# EasyEDA schematic SCH_RP2040_Carrier_Board_for_AC_and_Measurement_Applications.json

## Sheets
1 Temperature/Analog Multiplexer: TITLE: Temperature Sensors and one Hygro; REV: 1.0; Date: 2022-06-06; Sheet: 1/4; Drawn By: GoRoNb; Company: https://github.com/gormr
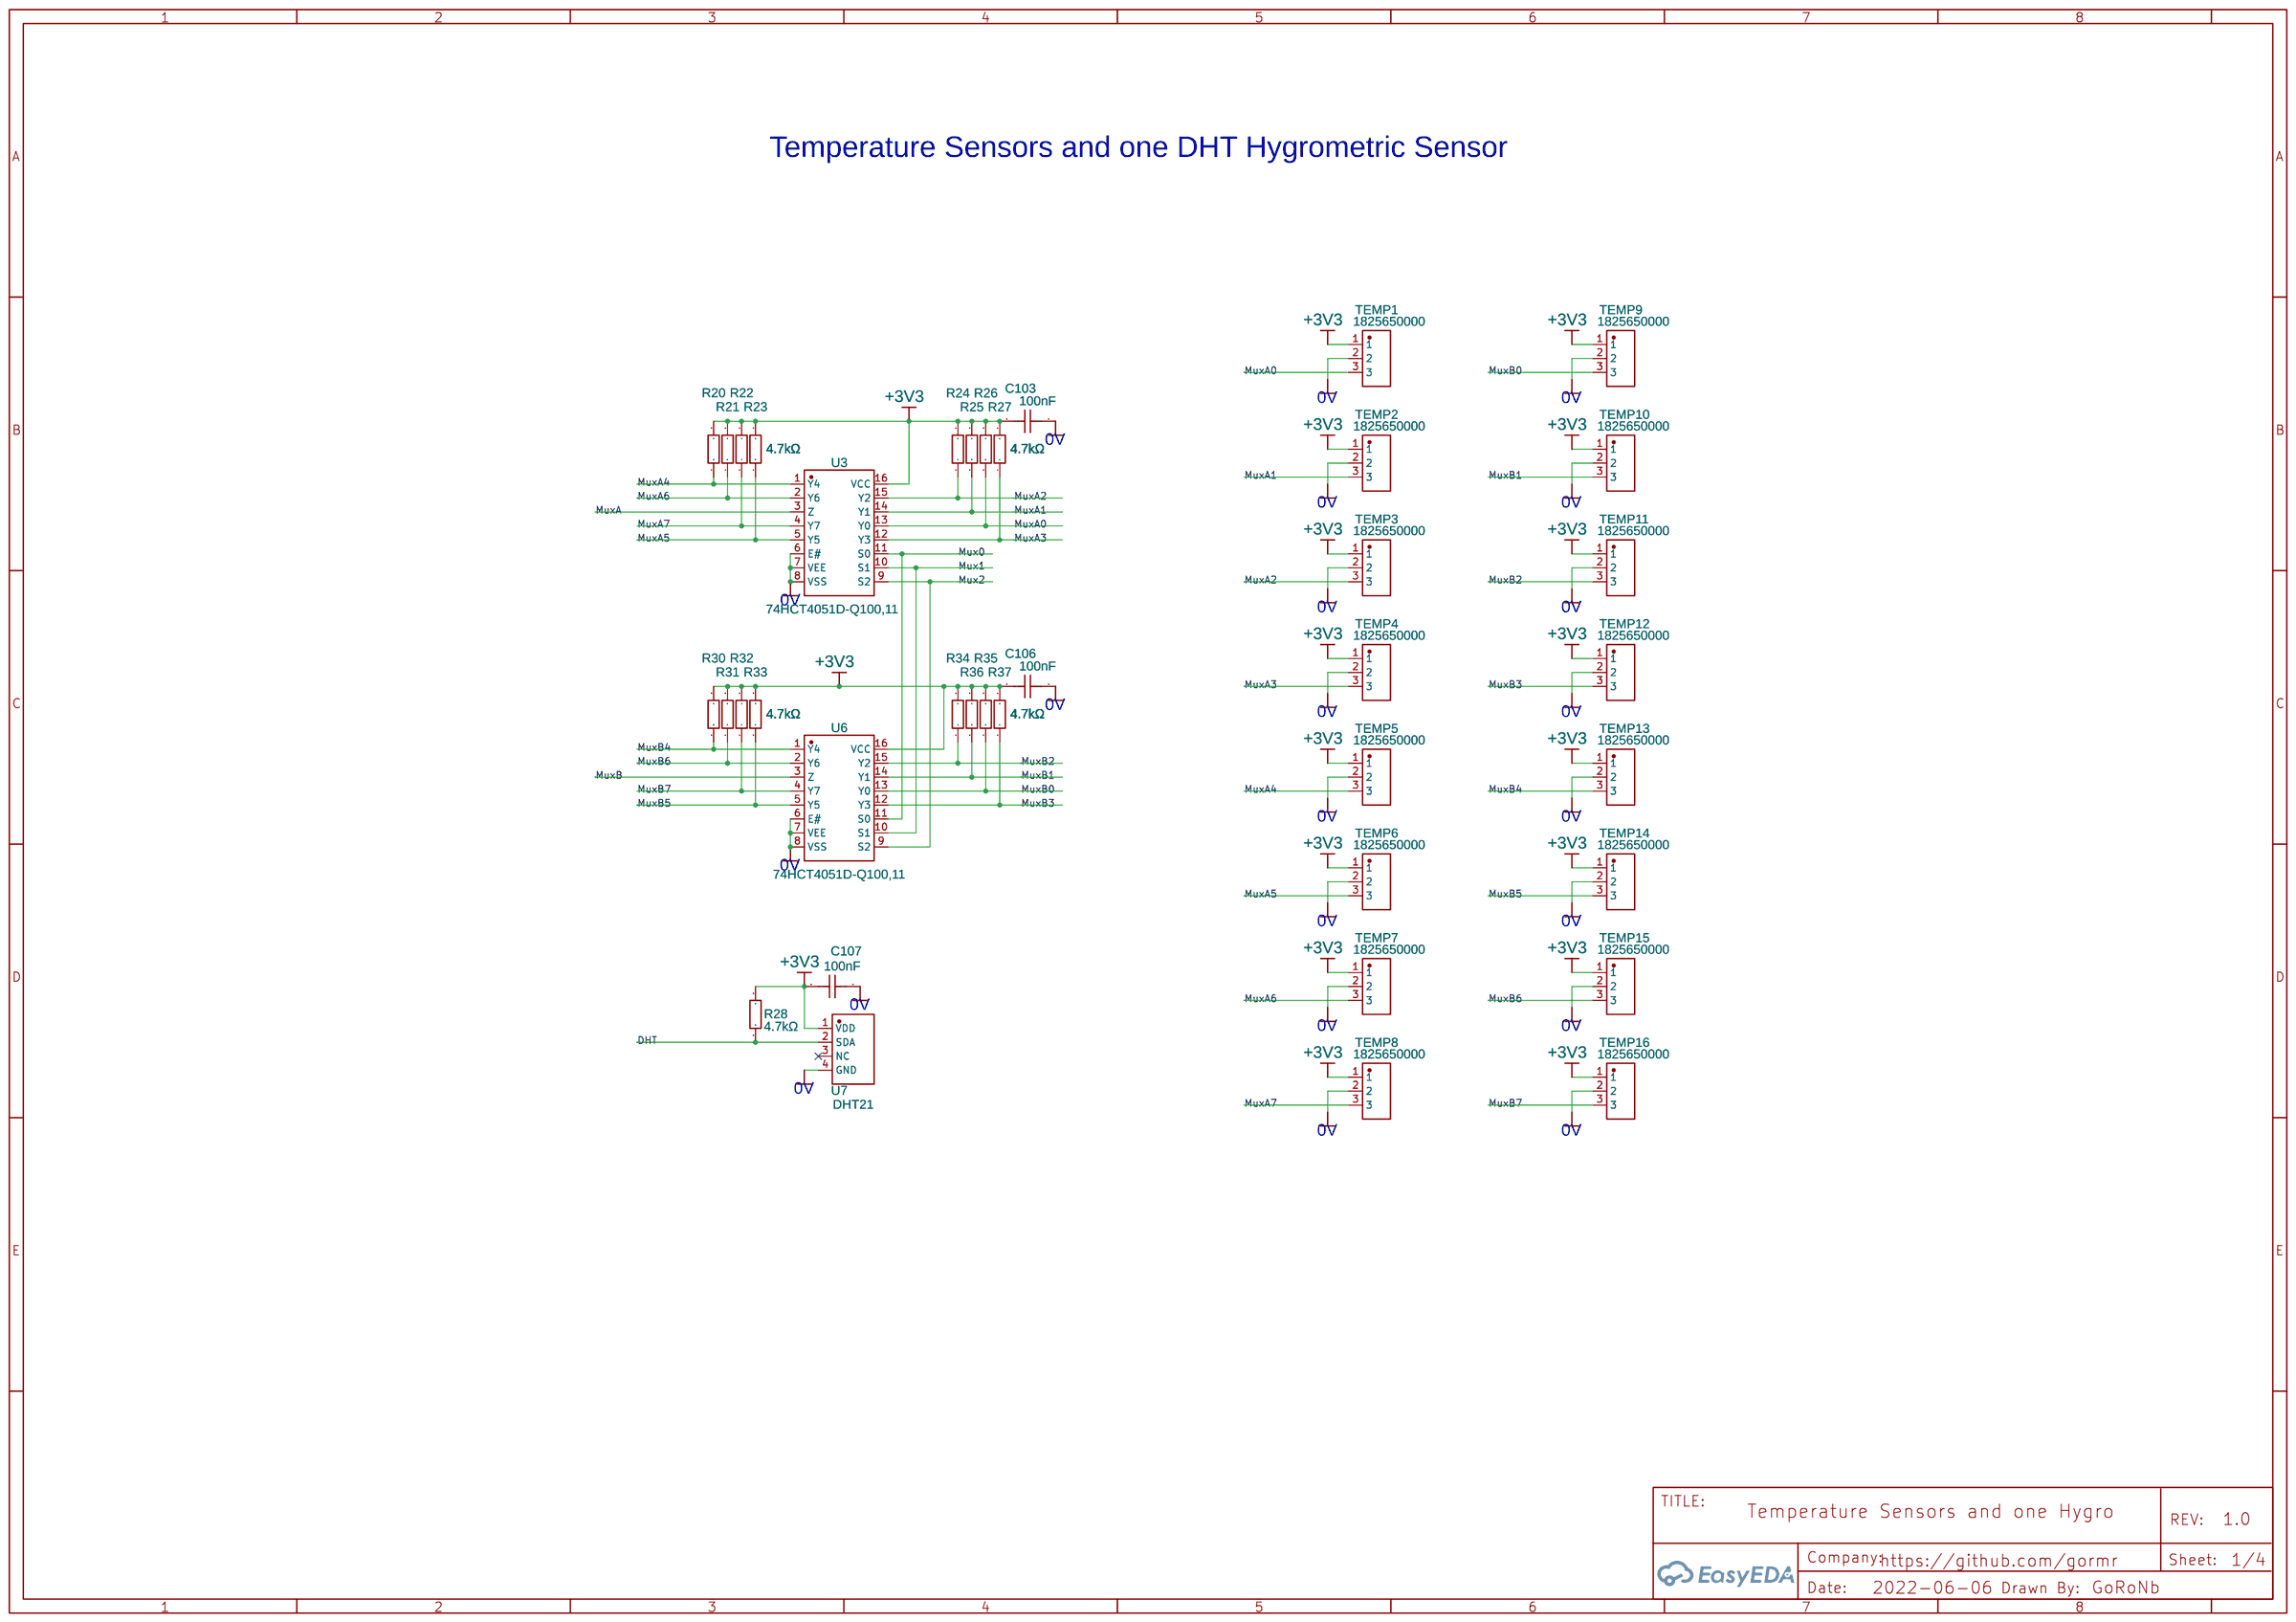
[diagram p0: Temperature/Analog Multiplexer]
2 Controller Unit: TITLE: µC Unit; Sheet: 2/4
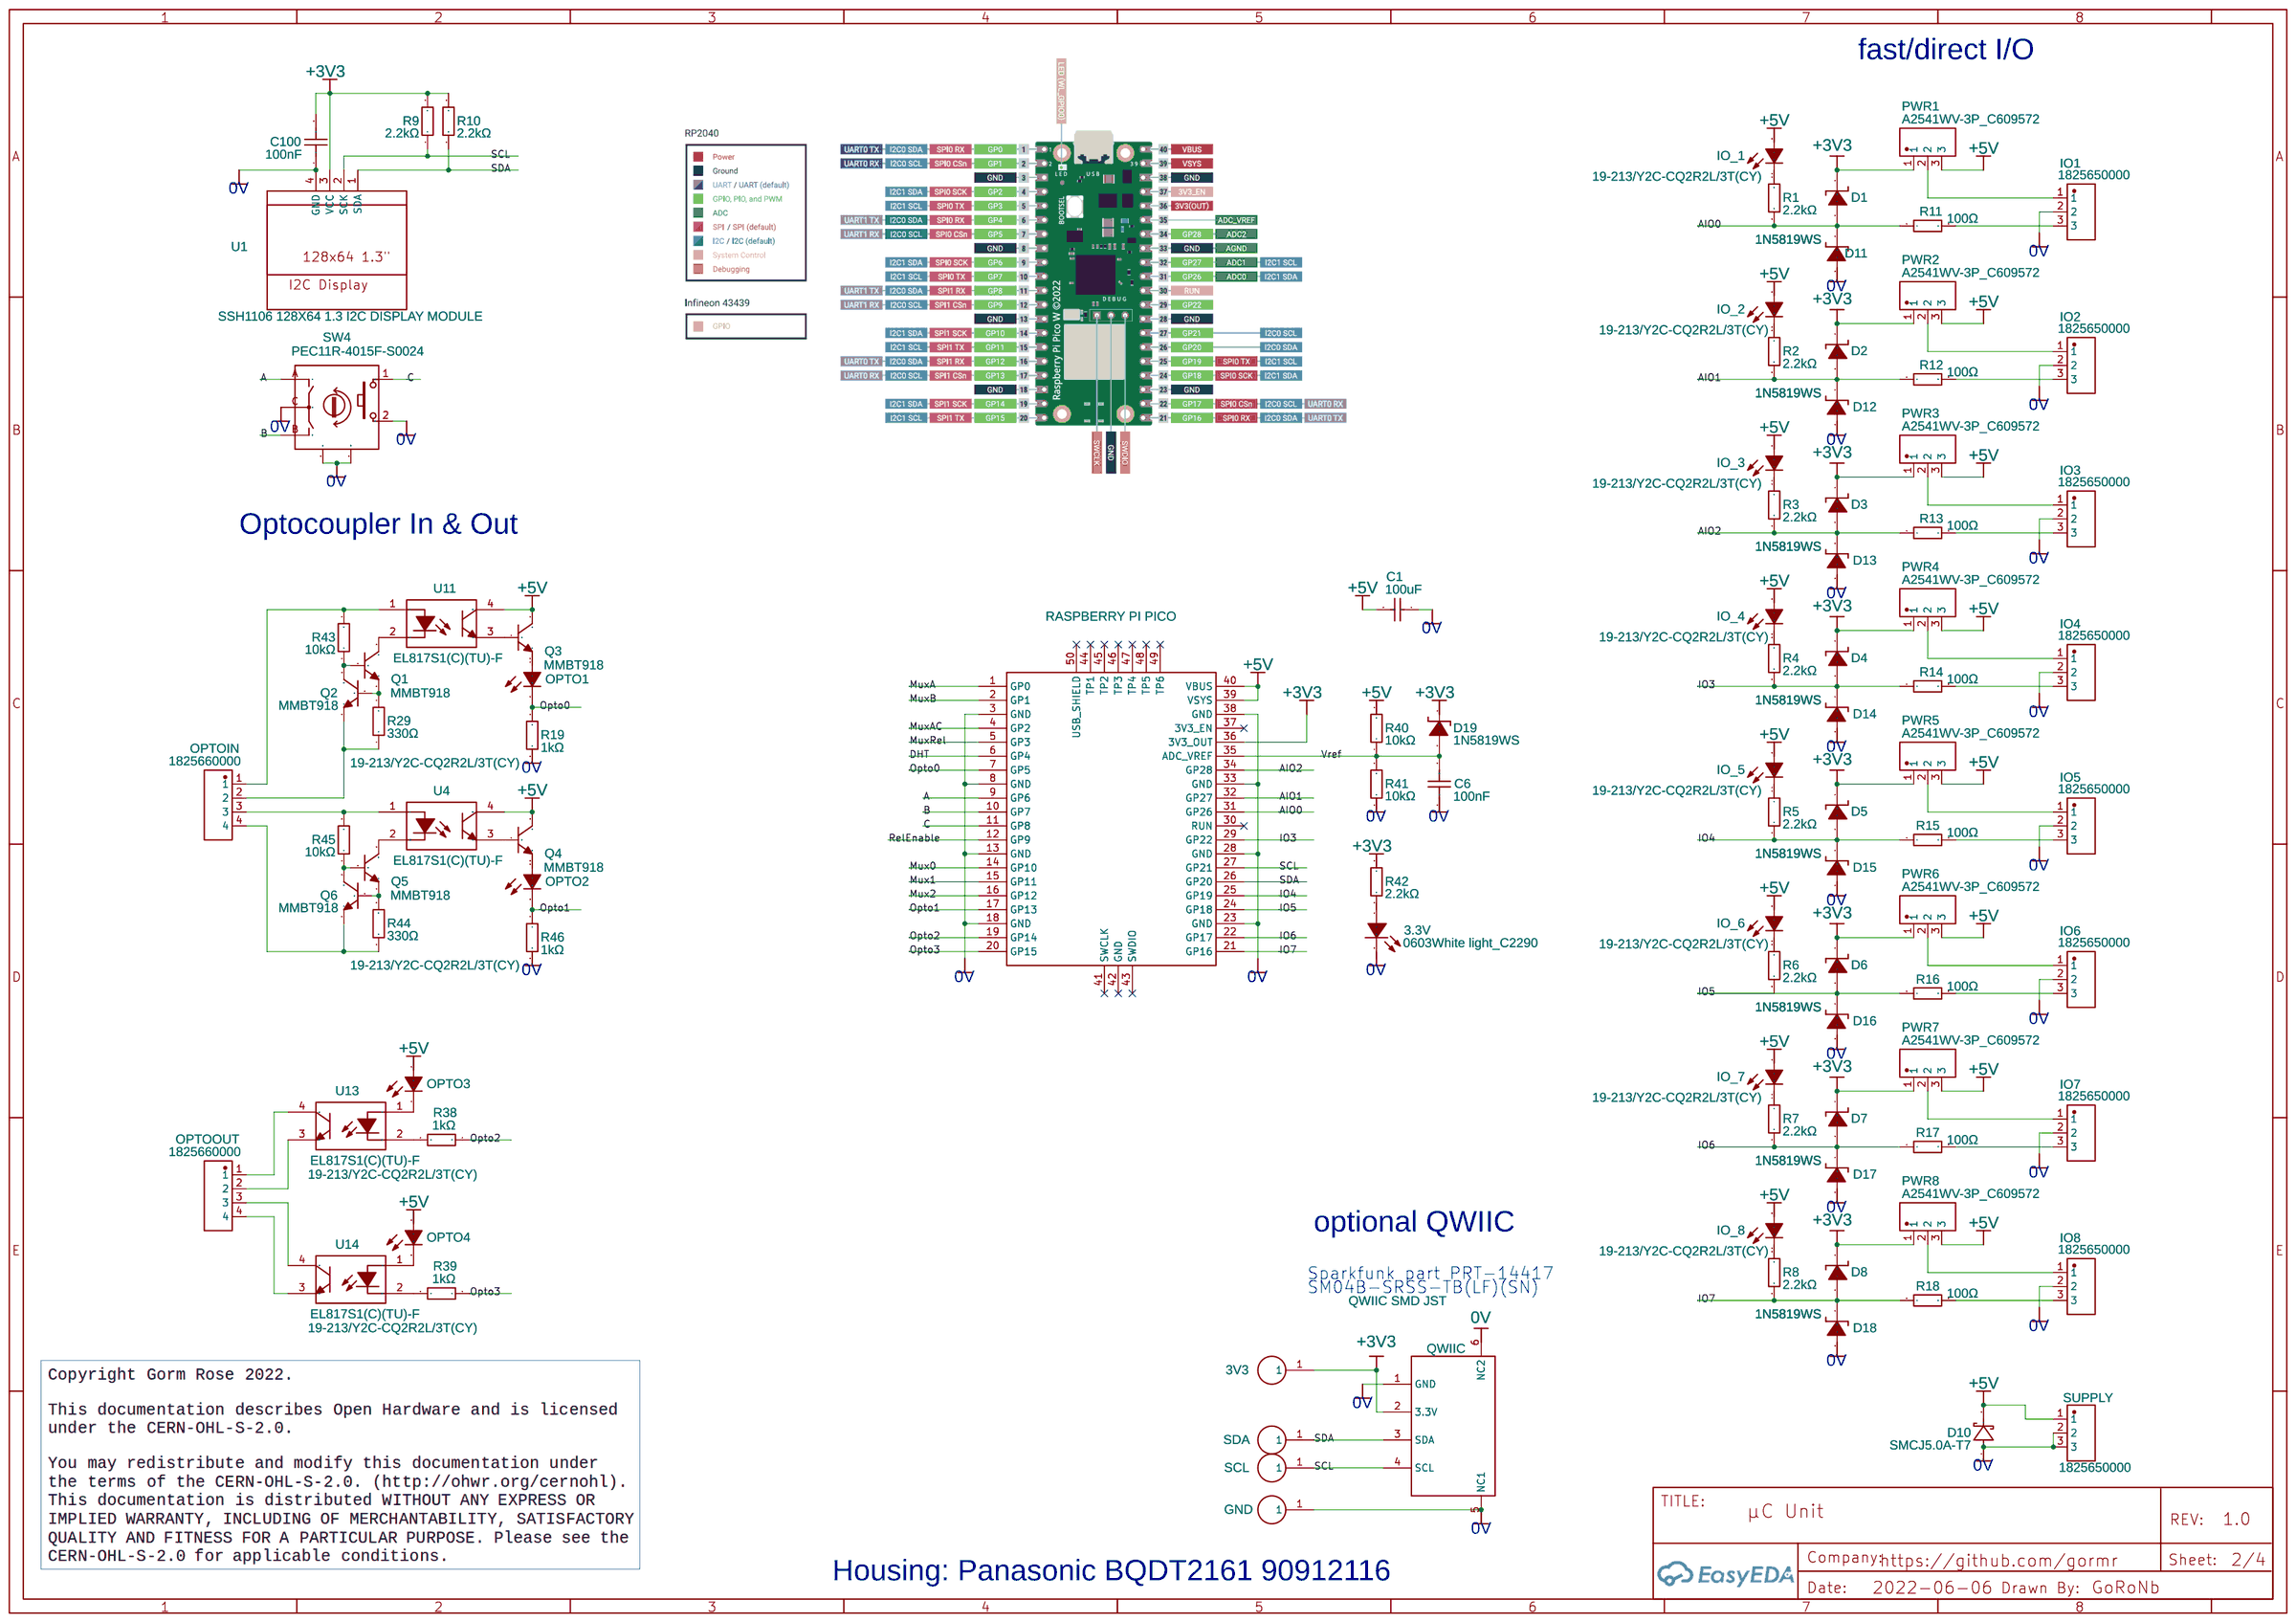
[diagram p1: Controller Unit]
3 AC inputs: TITLE: AC inputs; Sheet: 3/4
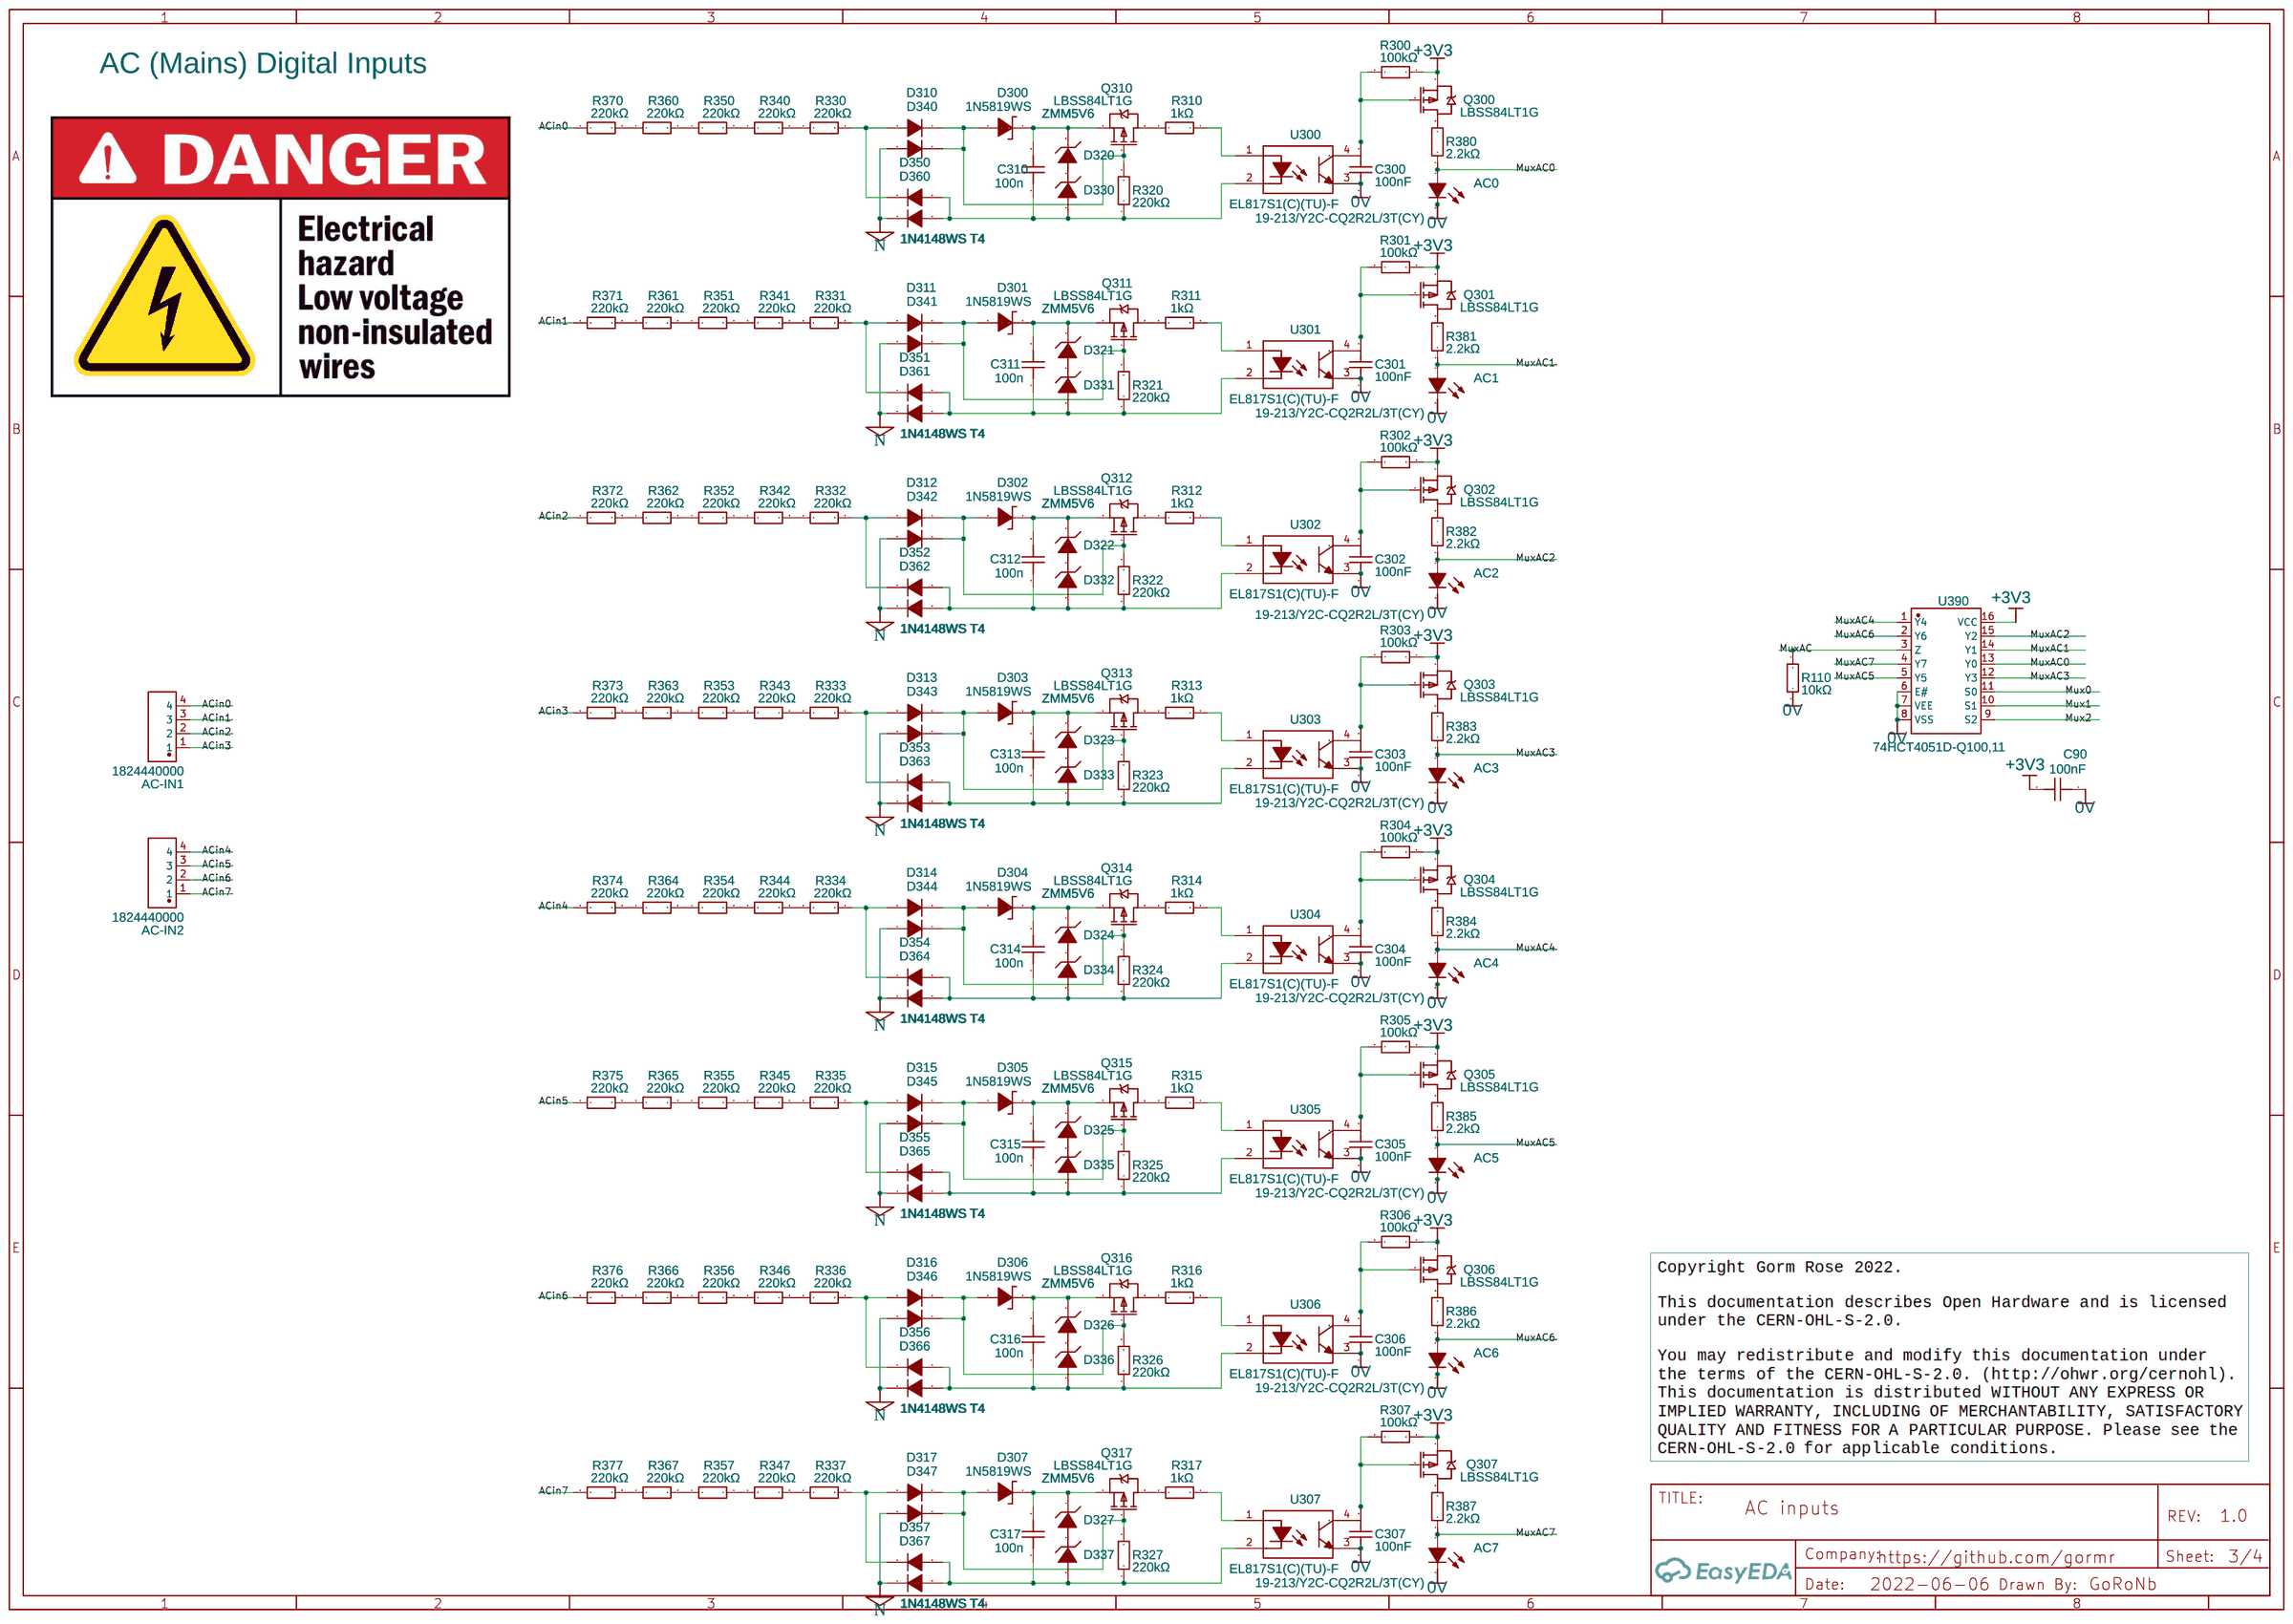
[diagram p2: AC inputs]
4 Relay Outputs: TITLE: Relay Outputs; Sheet: 4/4
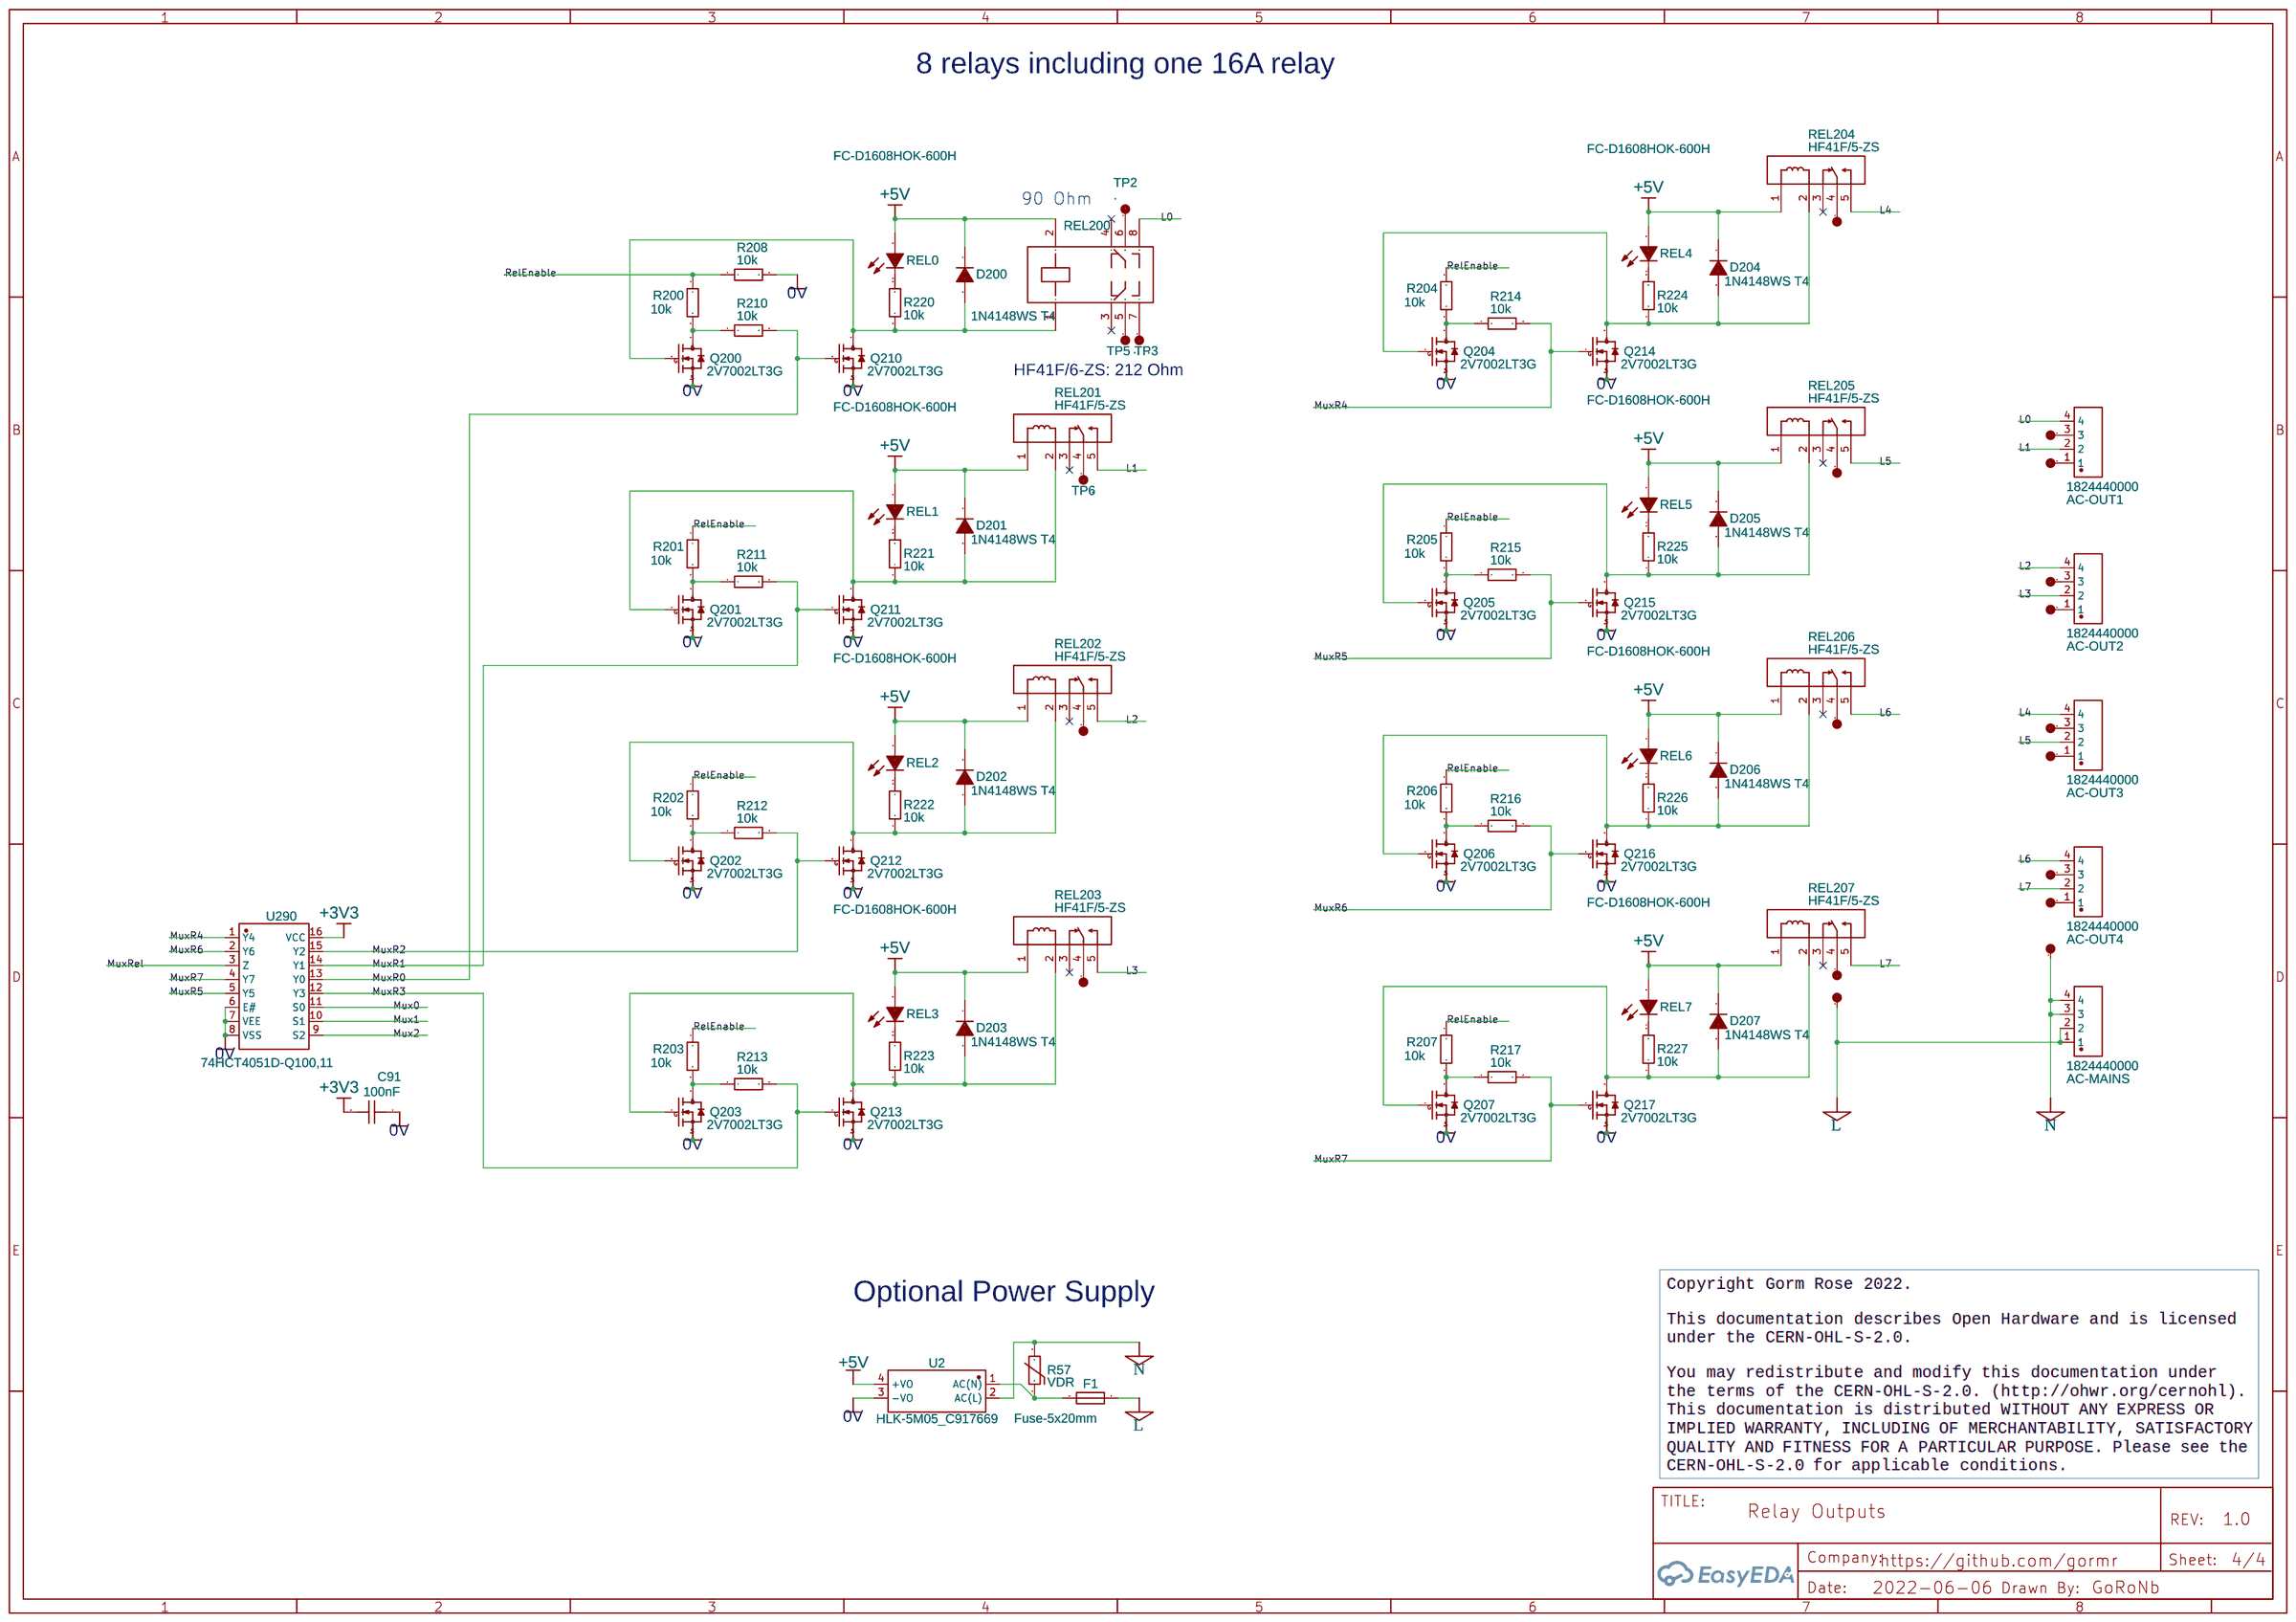
[diagram p3: Relay Outputs]

## Parts
sheet AC inputs
AC0  19-213/Y2C-CQ2R2L/3T(CY)  [LED0603-R-RD]
AC1  19-213/Y2C-CQ2R2L/3T(CY)  [LED0603-R-RD]
AC2  19-213/Y2C-CQ2R2L/3T(CY)  [LED0603-R-RD]
AC3  19-213/Y2C-CQ2R2L/3T(CY)  [LED0603-R-RD]
AC4  19-213/Y2C-CQ2R2L/3T(CY)  [LED0603-R-RD]
AC5  19-213/Y2C-CQ2R2L/3T(CY)  [LED0603-R-RD]
AC6  19-213/Y2C-CQ2R2L/3T(CY)  [LED0603-R-RD]
AC7  19-213/Y2C-CQ2R2L/3T(CY)  [LED0603-R-RD]
AC-IN1  1824440000  [1824440000]
AC-IN2  1824440000  [1824440000]
C90  100nF  [C0603]
C300  100nF  [C0603]
C301  100nF  [C0603]
C302  100nF  [C0603]
C303  100nF  [C0603]
C304  100nF  [C0603]
C305  100nF  [C0603]
C306  100nF  [C0603]
C307  100nF  [C0603]
C310  100n  [C0603]
C311  100n  [C0603]
C312  100n  [C0603]
C313  100n  [C0603]
C314  100n  [C0603]
C315  100n  [C0603]
C316  100n  [C0603]
C317  100n  [C0603]
D300  1N5819WS  [SOD-323_L1.8-W1.3-LS2.5-RD]
D301  1N5819WS  [SOD-323_L1.8-W1.3-LS2.5-RD]
D302  1N5819WS  [SOD-323_L1.8-W1.3-LS2.5-RD]
D303  1N5819WS  [SOD-323_L1.8-W1.3-LS2.5-RD]
D304  1N5819WS  [SOD-323_L1.8-W1.3-LS2.5-RD]
D305  1N5819WS  [SOD-323_L1.8-W1.3-LS2.5-RD]
D306  1N5819WS  [SOD-323_L1.8-W1.3-LS2.5-RD]
D307  1N5819WS  [SOD-323_L1.8-W1.3-LS2.5-RD]
D310  1N4148WS T4  [SOD-323_L1.8-W1.3-LS2.5-RD]
D311  1N4148WS T4  [SOD-323_L1.8-W1.3-LS2.5-RD]
D312  1N4148WS T4  [SOD-323_L1.8-W1.3-LS2.5-RD]
D313  1N4148WS T4  [SOD-323_L1.8-W1.3-LS2.5-RD]
D314  1N4148WS T4  [SOD-323_L1.8-W1.3-LS2.5-RD]
D315  1N4148WS T4  [SOD-323_L1.8-W1.3-LS2.5-RD]
D316  1N4148WS T4  [SOD-323_L1.8-W1.3-LS2.5-RD]
D317  1N4148WS T4  [SOD-323_L1.8-W1.3-LS2.5-RD]
D320  ZMM5V6  [LL-34_L3.5-W1.5-RD]
D321  ZMM5V6  [LL-34_L3.5-W1.5-RD]
D322  ZMM5V6  [LL-34_L3.5-W1.5-RD]
D323  ZMM5V6  [LL-34_L3.5-W1.5-RD]
D324  ZMM5V6  [LL-34_L3.5-W1.5-RD]
D325  ZMM5V6  [LL-34_L3.5-W1.5-RD]
D326  ZMM5V6  [LL-34_L3.5-W1.5-RD]
D327  ZMM5V6  [LL-34_L3.5-W1.5-RD]
D330  ZMM5V6  [LL-34_L3.5-W1.5-RD]
D331  ZMM5V6  [LL-34_L3.5-W1.5-RD]
D332  ZMM5V6  [LL-34_L3.5-W1.5-RD]
D333  ZMM5V6  [LL-34_L3.5-W1.5-RD]
D334  ZMM5V6  [LL-34_L3.5-W1.5-RD]
D335  ZMM5V6  [LL-34_L3.5-W1.5-RD]
D336  ZMM5V6  [LL-34_L3.5-W1.5-RD]
D337  ZMM5V6  [LL-34_L3.5-W1.5-RD]
D340  1N4148WS T4  [SOD-323_L1.8-W1.3-LS2.5-RD]
D341  1N4148WS T4  [SOD-323_L1.8-W1.3-LS2.5-RD]
D342  1N4148WS T4  [SOD-323_L1.8-W1.3-LS2.5-RD]
D343  1N4148WS T4  [SOD-323_L1.8-W1.3-LS2.5-RD]
D344  1N4148WS T4  [SOD-323_L1.8-W1.3-LS2.5-RD]
D345  1N4148WS T4  [SOD-323_L1.8-W1.3-LS2.5-RD]
D346  1N4148WS T4  [SOD-323_L1.8-W1.3-LS2.5-RD]
D347  1N4148WS T4  [SOD-323_L1.8-W1.3-LS2.5-RD]
D350  1N4148WS T4  [SOD-323_L1.8-W1.3-LS2.5-RD]
D351  1N4148WS T4  [SOD-323_L1.8-W1.3-LS2.5-RD]
D352  1N4148WS T4  [SOD-323_L1.8-W1.3-LS2.5-RD]
D353  1N4148WS T4  [SOD-323_L1.8-W1.3-LS2.5-RD]
D354  1N4148WS T4  [SOD-323_L1.8-W1.3-LS2.5-RD]
D355  1N4148WS T4  [SOD-323_L1.8-W1.3-LS2.5-RD]
D356  1N4148WS T4  [SOD-323_L1.8-W1.3-LS2.5-RD]
D357  1N4148WS T4  [SOD-323_L1.8-W1.3-LS2.5-RD]
D360  1N4148WS T4  [SOD-323_L1.8-W1.3-LS2.5-RD]
D361  1N4148WS T4  [SOD-323_L1.8-W1.3-LS2.5-RD]
D362  1N4148WS T4  [SOD-323_L1.8-W1.3-LS2.5-RD]
D363  1N4148WS T4  [SOD-323_L1.8-W1.3-LS2.5-RD]
D364  1N4148WS T4  [SOD-323_L1.8-W1.3-LS2.5-RD]
D365  1N4148WS T4  [SOD-323_L1.8-W1.3-LS2.5-RD]
D366  1N4148WS T4  [SOD-323_L1.8-W1.3-LS2.5-RD]
D367  1N4148WS T4  [SOD-323_L1.8-W1.3-LS2.5-RD]
Q300  LBSS84LT1G  [SOT-23_L2.9-W1.3-P1.90-LS2.4-BR]
Q301  LBSS84LT1G  [SOT-23_L2.9-W1.3-P1.90-LS2.4-BR]
Q302  LBSS84LT1G  [SOT-23_L2.9-W1.3-P1.90-LS2.4-BR]
Q303  LBSS84LT1G  [SOT-23_L2.9-W1.3-P1.90-LS2.4-BR]
Q304  LBSS84LT1G  [SOT-23_L2.9-W1.3-P1.90-LS2.4-BR]
Q305  LBSS84LT1G  [SOT-23_L2.9-W1.3-P1.90-LS2.4-BR]
Q306  LBSS84LT1G  [SOT-23_L2.9-W1.3-P1.90-LS2.4-BR]
Q307  LBSS84LT1G  [SOT-23_L2.9-W1.3-P1.90-LS2.4-BR]
Q310  LBSS84LT1G  [SOT-23_L2.9-W1.3-P1.90-LS2.4-BR]
Q311  LBSS84LT1G  [SOT-23_L2.9-W1.3-P1.90-LS2.4-BR]
Q312  LBSS84LT1G  [SOT-23_L2.9-W1.3-P1.90-LS2.4-BR]
Q313  LBSS84LT1G  [SOT-23_L2.9-W1.3-P1.90-LS2.4-BR]
Q314  LBSS84LT1G  [SOT-23_L2.9-W1.3-P1.90-LS2.4-BR]
Q315  LBSS84LT1G  [SOT-23_L2.9-W1.3-P1.90-LS2.4-BR]
Q316  LBSS84LT1G  [SOT-23_L2.9-W1.3-P1.90-LS2.4-BR]
Q317  LBSS84LT1G  [SOT-23_L2.9-W1.3-P1.90-LS2.4-BR]
R110  10kΩ  [R0603]
R300  100kΩ  [R0603]
R301  100kΩ  [R0603]
R302  100kΩ  [R0603]
R303  100kΩ  [R0603]
R304  100kΩ  [R0603]
R305  100kΩ  [R0603]
R306  100kΩ  [R0603]
R307  100kΩ  [R0603]
R310  1kΩ  [R0603]
R311  1kΩ  [R0603]
R312  1kΩ  [R0603]
R313  1kΩ  [R0603]
R314  1kΩ  [R0603]
R315  1kΩ  [R0603]
R316  1kΩ  [R0603]
R317  1kΩ  [R0603]
R320  220kΩ  [R0805]
R321  220kΩ  [R0805]
R322  220kΩ  [R0805]
R323  220kΩ  [R0805]
R324  220kΩ  [R0805]
R325  220kΩ  [R0805]
R326  220kΩ  [R0805]
R327  220kΩ  [R0805]
R330  220kΩ  [R0805]
R331  220kΩ  [R0805]
R332  220kΩ  [R0805]
R333  220kΩ  [R0805]
R334  220kΩ  [R0805]
R335  220kΩ  [R0805]
R336  220kΩ  [R0805]
R337  220kΩ  [R0805]
R340  220kΩ  [R0805]
R341  220kΩ  [R0805]
R342  220kΩ  [R0805]
R343  220kΩ  [R0805]
R344  220kΩ  [R0805]
R345  220kΩ  [R0805]
R346  220kΩ  [R0805]
R347  220kΩ  [R0805]
R350  220kΩ  [R0805]
R351  220kΩ  [R0805]
R352  220kΩ  [R0805]
R353  220kΩ  [R0805]
R354  220kΩ  [R0805]
R355  220kΩ  [R0805]
R356  220kΩ  [R0805]
R357  220kΩ  [R0805]
R360  220kΩ  [R0805]
R361  220kΩ  [R0805]
R362  220kΩ  [R0805]
R363  220kΩ  [R0805]
R364  220kΩ  [R0805]
R365  220kΩ  [R0805]
R366  220kΩ  [R0805]
R367  220kΩ  [R0805]
R370  220kΩ  [R0805]
R371  220kΩ  [R0805]
R372  220kΩ  [R0805]
R373  220kΩ  [R0805]
R374  220kΩ  [R0805]
R375  220kΩ  [R0805]
R376  220kΩ  [R0805]
R377  220kΩ  [R0805]
R380  2.2kΩ  [R0603]
R381  2.2kΩ  [R0603]
R382  2.2kΩ  [R0603]
R383  2.2kΩ  [R0603]
R384  2.2kΩ  [R0603]
R385  2.2kΩ  [R0603]
R386  2.2kΩ  [R0603]
R387  2.2kΩ  [R0603]
U300  EL817S1(C)(TU)-F  [OPTO-SMD-4_L4.6-W6.5-P2.54-LS10.3-TL]
U301  EL817S1(C)(TU)-F  [OPTO-SMD-4_L4.6-W6.5-P2.54-LS10.3-TL]
U302  EL817S1(C)(TU)-F  [OPTO-SMD-4_L4.6-W6.5-P2.54-LS10.3-TL]
U303  EL817S1(C)(TU)-F  [OPTO-SMD-4_L4.6-W6.5-P2.54-LS10.3-TL]
U304  EL817S1(C)(TU)-F  [OPTO-SMD-4_L4.6-W6.5-P2.54-LS10.3-TL]
U305  EL817S1(C)(TU)-F  [OPTO-SMD-4_L4.6-W6.5-P2.54-LS10.3-TL]
U306  EL817S1(C)(TU)-F  [OPTO-SMD-4_L4.6-W6.5-P2.54-LS10.3-TL]
U307  EL817S1(C)(TU)-F  [OPTO-SMD-4_L4.6-W6.5-P2.54-LS10.3-TL]
U390  74HCT4051D-Q100,11  [SO-16_L9.9-W3.9-P1.27-LS6.0-BL]
sheet Controller Unit
3.3V  0603White light_C2290  [LED0603-R-RD_WHITE]
3V3  10mA max.  [TESTPOINT]
C1  100uF  [C1206]
C6  100nF  [C0603]
C100  100nF  [C0603]
D1  1N5819WS  [SOD-323_L1.8-W1.3-LS2.5-RD]
D2  1N5819WS  [SOD-323_L1.8-W1.3-LS2.5-RD]
D3  1N5819WS  [SOD-323_L1.8-W1.3-LS2.5-RD]
D4  1N5819WS  [SOD-323_L1.8-W1.3-LS2.5-RD]
D5  1N5819WS  [SOD-323_L1.8-W1.3-LS2.5-RD]
D6  1N5819WS  [SOD-323_L1.8-W1.3-LS2.5-RD]
D7  1N5819WS  [SOD-323_L1.8-W1.3-LS2.5-RD]
D8  1N5819WS  [SOD-323_L1.8-W1.3-LS2.5-RD]
D10  SMCJ5.0A-T7  [SMC_L6.9-W5.9-LS7.9-R-RD]
D11  1N5819WS  [SOD-323_L1.8-W1.3-LS2.5-RD]
D12  1N5819WS  [SOD-323_L1.8-W1.3-LS2.5-RD]
D13  1N5819WS  [SOD-323_L1.8-W1.3-LS2.5-RD]
D14  1N5819WS  [SOD-323_L1.8-W1.3-LS2.5-RD]
D15  1N5819WS  [SOD-323_L1.8-W1.3-LS2.5-RD]
D16  1N5819WS  [SOD-323_L1.8-W1.3-LS2.5-RD]
D17  1N5819WS  [SOD-323_L1.8-W1.3-LS2.5-RD]
D18  1N5819WS  [SOD-323_L1.8-W1.3-LS2.5-RD]
D19  1N5819WS  [SOD-323_L1.8-W1.3-LS2.5-RD]
GND  10mA max.  [TESTPOINT]
GP1  RASPBERRY PI PICO  [RASPBERRY PI PICO]
IO1  1825650000  [1825650000]
IO2  1825650000  [1825650000]
IO3  1825650000  [1825650000]
IO4  1825650000  [1825650000]
IO5  1825650000  [1825650000]
IO6  1825650000  [1825650000]
IO7  1825650000  [1825650000]
IO8  1825650000  [1825650000]
IO_1  19-213/Y2C-CQ2R2L/3T(CY)  [LED0603-RD]
IO_2  19-213/Y2C-CQ2R2L/3T(CY)  [LED0603-RD]
IO_3  19-213/Y2C-CQ2R2L/3T(CY)  [LED0603-RD]
IO_4  19-213/Y2C-CQ2R2L/3T(CY)  [LED0603-RD]
IO_5  19-213/Y2C-CQ2R2L/3T(CY)  [LED0603-RD]
IO_6  19-213/Y2C-CQ2R2L/3T(CY)  [LED0603-RD]
IO_7  19-213/Y2C-CQ2R2L/3T(CY)  [LED0603-RD]
IO_8  19-213/Y2C-CQ2R2L/3T(CY)  [LED0603-RD]
OPTO1  19-213/Y2C-CQ2R2L/3T(CY)  [LED0603-R-RD]
OPTO2  19-213/Y2C-CQ2R2L/3T(CY)  [LED0603-R-RD]
OPTO3  19-213/Y2C-CQ2R2L/3T(CY)  [LED0603-R-RD]
OPTO4  19-213/Y2C-CQ2R2L/3T(CY)  [LED0603-R-RD]
OPTOIN  1825660000  [1825660000]
OPTOOUT  1825660000  [1825660000]
PWR1  A2541WV-3P_C609572  [HDR-TH_3P-P2.54-V-M]
PWR2  A2541WV-3P_C609572  [HDR-TH_3P-P2.54-V-M]
PWR3  A2541WV-3P_C609572  [HDR-TH_3P-P2.54-V-M]
PWR4  A2541WV-3P_C609572  [HDR-TH_3P-P2.54-V-M]
PWR5  A2541WV-3P_C609572  [HDR-TH_3P-P2.54-V-M]
PWR6  A2541WV-3P_C609572  [HDR-TH_3P-P2.54-V-M]
PWR7  A2541WV-3P_C609572  [HDR-TH_3P-P2.54-V-M]
PWR8  A2541WV-3P_C609572  [HDR-TH_3P-P2.54-V-M]
Q1  MMBT918  [SOT-23-3_L2.9-W1.3-P1.90-LS2.4-BR]
Q2  MMBT918  [SOT-23-3_L2.9-W1.3-P1.90-LS2.4-BR]
Q3  MMBT918  [SOT-23-3_L2.9-W1.3-P1.90-LS2.4-BR]
Q4  MMBT918  [SOT-23-3_L2.9-W1.3-P1.90-LS2.4-BR]
Q5  MMBT918  [SOT-23-3_L2.9-W1.3-P1.90-LS2.4-BR]
Q6  MMBT918  [SOT-23-3_L2.9-W1.3-P1.90-LS2.4-BR]
QWIIC  QWIIC SMD JST  [QWIIC CONNECTOR]
R1  2.2kΩ  [R0603]
R2  2.2kΩ  [R0603]
R3  2.2kΩ  [R0603]
R4  2.2kΩ  [R0603]
R5  2.2kΩ  [R0603]
R6  2.2kΩ  [R0603]
R7  2.2kΩ  [R0603]
R8  2.2kΩ  [R0603]
R9  2.2kΩ  [R0603]
R10  2.2kΩ  [R0603]
R11  100Ω  [R0603]
R12  100Ω  [R0603]
R13  100Ω  [R0603]
R14  100Ω  [R0603]
R15  100Ω  [R0603]
R16  100Ω  [R0603]
R17  100Ω  [R0603]
R18  100Ω  [R0603]
R19  1kΩ  [R0603]
R29  330Ω  [R0603]
R38  1kΩ  [R0603]
R39  1kΩ  [R0603]
R40  10kΩ  [R0603]
R41  10kΩ  [R0603]
R42  2.2kΩ  [R0603]
R43  10kΩ  [R0603]
R44  330Ω  [R0603]
R45  10kΩ  [R0603]
R46  1kΩ  [R0603]
SCL  10mA max.  [TESTPOINT]
SDA  10mA max.  [TESTPOINT]
SUPPLY  1825650000  [1825650000]
SW4  PEC11R-4015F-S0024  [SW-TH_PEC11R-4XXXF-SXXXX]
U1  SSH1106 128X64 1.3 I2C DISPLAY MODULE  [SSH1106 128X64 1.3 I2C OLED DISPLAY MODULE]
U4  EL817S1(C)(TU)-F  [OPTO-SMD-4_L4.6-W6.5-P2.54-LS10.3-TL]
U11  EL817S1(C)(TU)-F  [OPTO-SMD-4_L4.6-W6.5-P2.54-LS10.3-TL]
U13  EL817S1(C)(TU)-F  [OPTO-SMD-4_L4.6-W6.5-P2.54-LS10.3-TL]
U14  EL817S1(C)(TU)-F  [OPTO-SMD-4_L4.6-W6.5-P2.54-LS10.3-TL]
sheet Relay Outputs
AC-MAINS  1824440000  [1824440000]
AC-OUT1  1824440000  [1824440000]
AC-OUT2  1824440000  [1824440000]
AC-OUT3  1824440000  [1824440000]
AC-OUT4  1824440000  [1824440000]
C91  100nF  [C0603]
D200  1N4148WS T4  [SOD-323_L1.8-W1.3-LS2.5-RD]
D201  1N4148WS T4  [SOD-323_L1.8-W1.3-LS2.5-RD]
D202  1N4148WS T4  [SOD-323_L1.8-W1.3-LS2.5-RD]
D203  1N4148WS T4  [SOD-323_L1.8-W1.3-LS2.5-RD]
D204  1N4148WS T4  [SOD-323_L1.8-W1.3-LS2.5-RD]
D205  1N4148WS T4  [SOD-323_L1.8-W1.3-LS2.5-RD]
D206  1N4148WS T4  [SOD-323_L1.8-W1.3-LS2.5-RD]
D207  1N4148WS T4  [SOD-323_L1.8-W1.3-LS2.5-RD]
F1  Fuse-5x20mm  [FUSE-HOLDER-5X20MM]
Q200  2V7002LT3G  [SOT-23-3_L2.9-W1.3-P1.90-LS2.4-BR]
Q201  2V7002LT3G  [SOT-23-3_L2.9-W1.3-P1.90-LS2.4-BR]
Q202  2V7002LT3G  [SOT-23-3_L2.9-W1.3-P1.90-LS2.4-BR]
Q203  2V7002LT3G  [SOT-23-3_L2.9-W1.3-P1.90-LS2.4-BR]
Q204  2V7002LT3G  [SOT-23-3_L2.9-W1.3-P1.90-LS2.4-BR]
Q205  2V7002LT3G  [SOT-23-3_L2.9-W1.3-P1.90-LS2.4-BR]
Q206  2V7002LT3G  [SOT-23-3_L2.9-W1.3-P1.90-LS2.4-BR]
Q207  2V7002LT3G  [SOT-23-3_L2.9-W1.3-P1.90-LS2.4-BR]
Q210  2V7002LT3G  [SOT-23-3_L2.9-W1.3-P1.90-LS2.4-BR]
Q211  2V7002LT3G  [SOT-23-3_L2.9-W1.3-P1.90-LS2.4-BR]
Q212  2V7002LT3G  [SOT-23-3_L2.9-W1.3-P1.90-LS2.4-BR]
Q213  2V7002LT3G  [SOT-23-3_L2.9-W1.3-P1.90-LS2.4-BR]
Q214  2V7002LT3G  [SOT-23-3_L2.9-W1.3-P1.90-LS2.4-BR]
Q215  2V7002LT3G  [SOT-23-3_L2.9-W1.3-P1.90-LS2.4-BR]
Q216  2V7002LT3G  [SOT-23-3_L2.9-W1.3-P1.90-LS2.4-BR]
Q217  2V7002LT3G  [SOT-23-3_L2.9-W1.3-P1.90-LS2.4-BR]
R57  VDR  [RES-TH_L12.5-W5.1-P7.50-D1.2-S2.20]
R200  10k  [R0603]
R201  10k  [R0603]
R202  10k  [R0603]
R203  10k  [R0603]
R204  10k  [R0603]
R205  10k  [R0603]
R206  10k  [R0603]
R207  10k  [R0603]
R208  10k  [R0603]
R210  10k  [R0603]
R211  10k  [R0603]
R212  10k  [R0603]
R213  10k  [R0603]
R214  10k  [R0603]
R215  10k  [R0603]
R216  10k  [R0603]
R217  10k  [R0603]
R220  10k  [R0603]
R221  10k  [R0603]
R222  10k  [R0603]
R223  10k  [R0603]
R224  10k  [R0603]
R225  10k  [R0603]
R226  10k  [R0603]
R227  10k  [R0603]
REL0  FC-D1608HOK-600H  [LED0603-RD]
REL1  FC-D1608HOK-600H  [LED0603-RD]
REL2  FC-D1608HOK-600H  [LED0603-RD]
REL3  FC-D1608HOK-600H  [LED0603-RD]
REL4  FC-D1608HOK-600H  [LED0603-RD]
REL5  FC-D1608HOK-600H  [LED0603-RD]
REL6  FC-D1608HOK-600H  [LED0603-RD]
REL7  FC-D1608HOK-600H  [LED0603-RD]
REL200  HF115F/012-2ZS4AF  [RELAY-TH_HF115F-XXX-2XX4XX]
REL201  HF41F/5-ZS  [RELAY-TH_HF41F-5-ZS]
REL202  HF41F/5-ZS  [RELAY-TH_HF41F-5-ZS]
REL203  HF41F/5-ZS  [RELAY-TH_HF41F-5-ZS]
REL204  HF41F/5-ZS  [RELAY-TH_HF41F-5-ZS]
REL205  HF41F/5-ZS  [RELAY-TH_HF41F-5-ZS]
REL206  HF41F/5-ZS  [RELAY-TH_HF41F-5-ZS]
REL207  HF41F/5-ZS  [RELAY-TH_HF41F-5-ZS]
TP1  .  [TESTPAD-SMD-Ø1.2]
TP2  .  [TESTPAD-SMD-Ø1.2]
TP3  .  [TESTPAD-SMD-Ø1.2]
TP4  .  [TESTPAD-SMD-Ø1.2]
TP5  .  [TESTPAD-SMD-Ø1.2]
TP6  .  [TESTPAD-SMD-Ø1.2]
TP7  .  [TESTPAD-SMD-Ø1.2]
TP8  .  [TESTPAD-SMD-Ø1.2]
TP9  .  [TESTPAD-SMD-Ø1.2]
TP10  .  [TESTPAD-SMD-Ø1.2]
TP11  .  [TESTPAD-SMD-Ø1.2]
TP12  .  [TESTPAD-SMD-Ø1.2]
TP13  .  [TESTPAD-SMD-Ø1.2]
TP14  .  [TESTPAD-SMD-Ø1.2]
TP15  .  [TESTPAD-SMD-Ø1.2]
TP16  .  [TESTPAD-SMD-Ø1.2]
TP17  .  [TESTPAD-SMD-Ø1.2]
TP18  .  [TESTPAD-SMD-Ø1.2]
TP19  .  [TESTPAD-SMD-Ø1.2]
TP20  .  [TESTPAD-SMD-Ø1.2]
U2  HLK-5M05_C917669  [PWRM-TH_HLK-5M12_C917670]
U290  74HCT4051D-Q100,11  [SO-16_L9.9-W3.9-P1.27-LS6.0-BL]
sheet Temperature/Analog Multiplexer
C103  100nF  [C0603]
C106  100nF  [C0603]
C107  100nF  [C0603]
R20  4.7kΩ  [R0603]
R21  4.7kΩ  [R0603]
R22  4.7kΩ  [R0603]
R23  4.7kΩ  [R0603]
R24  4.7kΩ  [R0603]
R25  4.7kΩ  [R0603]
R26  4.7kΩ  [R0603]
R27  4.7kΩ  [R0603]
R28  4.7kΩ  [R0603]
R30  4.7kΩ  [R0603]
R31  4.7kΩ  [R0603]
R32  4.7kΩ  [R0603]
R33  4.7kΩ  [R0603]
R34  4.7kΩ  [R0603]
R35  4.7kΩ  [R0603]
R36  4.7kΩ  [R0603]
R37  4.7kΩ  [R0603]
TEMP1  1825650000  [1825650000]
TEMP2  1825650000  [1825650000]
TEMP3  1825650000  [1825650000]
TEMP4  1825650000  [1825650000]
TEMP5  1825650000  [1825650000]
TEMP6  1825650000  [1825650000]
TEMP7  1825650000  [1825650000]
TEMP8  1825650000  [1825650000]
TEMP9  1825650000  [1825650000]
TEMP10  1825650000  [1825650000]
TEMP11  1825650000  [1825650000]
TEMP12  1825650000  [1825650000]
TEMP13  1825650000  [1825650000]
TEMP14  1825650000  [1825650000]
TEMP15  1825650000  [1825650000]
TEMP16  1825650000  [1825650000]
U3  74HCT4051D-Q100,11  [SO-16_L9.9-W3.9-P1.27-LS6.0-BL]
U6  74HCT4051D-Q100,11  [SO-16_L9.9-W3.9-P1.27-LS6.0-BL]
U7  DHT21  [SENSOR-TH_HAIGU_DHT21]

## Library data of the parts
AC0-AC7 OPTO1-OPTO4 = 19-213/Y2C-CQ2R2L/3T(CY): Supplier: LCSC; Manufacturer: EVERLIGHT; Supplier Part: C72038; JLCPCB Part Class: Basic Part
AC-IN1 AC-IN2 AC-MAINS AC-OUT1-AC-OUT4 = 1824440000: Supplier Part: 281-2022-ND; Supplier: Digi-Key; Manufacturer: Weidmüller; JLCPCB Part Class: Extended Part; Contributor: GoRoNb
C6 C90 C91 C100 C103 C106 C107 C300-C307 = CC0603KRX7R9BB104: Supplier: LCSC; Manufacturer: YAGEO; Supplier Part: C14663; JLCPCB Part Class: Basic Part
C310-C317 = CC0603JRX7R8BB104: Supplier: LCSC; Contributor: LCSC
D1-D8 D11-D19 D300-D307 = 1N5819WS: Supplier: LCSC; Supplier Part: C191023; Manufacturer: Guangdong Hottech; Contributor: LCSC; JLCPCB Part Class: Basic Part
D200-D207 D310-D317 D340-D347 D350-D357 D360-D367 = 1N4148WS T4: Supplier: LCSC; Manufacturer: CJ(江苏长电/长晶); Manufacturer Part: 1N4148WS; Supplier Part: C2128; JLCPCB Part Class: Basic Part
D320-D327 D330-D337 = ZMM5V6: Supplier: LCSC; Manufacturer: SEMTECH; Supplier Part: C8062; JLCPCB Part Class: Basic Part
Q300-Q307 Q310-Q317 = LBSS84LT1G: Supplier: LCSC; Manufacturer: LRC; Supplier Part: C8492; JLCPCB Part Class: Basic Part
R40 R41 R43 R45 R110 = 0603WAF1002T5E: Supplier: LCSC; Manufacturer: UniOhm; Supplier Part: C25804; Resistance (Ohms): 10K; JLCPCB Part Class: Basic Part
R300-R307 = 0603WAF1003T5E: Supplier: LCSC; Manufacturer: UNI-ROYAL(厚声); Supplier Part: C25803; Resistance (Ohms): 100K; JLCPCB Part Class: Basic Part
R19 R38 R39 R46 R200-R208 R210-R217 R220-R227 R310-R317 = 0603WAF1001T5E: Supplier: LCSC; Manufacturer: UniOhm; Supplier Part: C21190; Resistance (Ohms): 1K; JLCPCB Part Class: Basic Part
R320-R327 R330-R337 R340-R347 R350-R357 R360-R367 R370-R377 = 0805W8F2203T5E: Supplier: LCSC; Manufacturer: UniOhm; Supplier Part: C17556; Resistance (Ohms): 220K; JLCPCB Part Class: Basic Part
R1-R10 R42 R380-R387 = 0603WAF2201T5E: Supplier: LCSC; Manufacturer: UniOhm; Supplier Part: C4190; Resistance (Ohms): 2.2K; JLCPCB Part Class: Basic Part
U4 U11 U13 U14 U300-U307 = EL817S1(C)(TU)-F: Supplier: LCSC; Manufacturer: EVERLIGHT; Supplier Part: C106900; JLCPCB Part Class: Basic Part
U3 U6 U290 U390 = 74HCT4051D-Q100,11: Supplier: LCSC; Supplier Part: C547698; Manufacturer: Nexperia; Contributor: LCSC; JLCPCB Part Class: Extended Part
3.3V = 0603White light_C2290: Supplier: LCSC; Manufacturer: KENTO; Manufacturer Part: 0603White light; Supplier Part: C2290; JLCPCB Part Class: Basic Part
3V3 GND SCL SDA = Testpoint: Contributor: jenipapo
C1 = CL31A107MQHNNNE: Supplier: LCSC; Manufacturer: SAMSUNG; Supplier Part: C15008; JLCPCB Part Class: Extended Part
D10 = SMCJ5.0A-T7: Supplier: LCSC; Supplier Part: C1983017; Manufacturer: Littelfuse(美国力特); Contributor: LCSC
GP1 = RASPBERRY PI PICO: Manufacturer: Raspberry Pi Foundation; Manufacturer Part: RPi Pico; Supplier: Raspberry Pi Foundation; Supplier Part: RPi Pico; link: https://www.raspberrypi.org/products/raspberry-pi-pico/specifications/; Contributor: PolishFuze
IO1-IO8 SUPPLY TEMP1-TEMP16 = 1825650000: Supplier: Digi-Key; Manufacturer: Weidmüller; Supplier Part: 281-2043-ND; JLCPCB Part Class: Extended Part
IO_1-IO_8 = FC-D1608HYK-588J: Supplier: LCSC; Manufacturer: EVERLIGHT; Supplier Part: C72038; SMT Type: Basic; JLCPCB SMD: Yes
OPTOIN OPTOOUT = 1825660000: Supplier: Digi-Key; Manufacturer: Weidmüller; Supplier Part: 281-2044-ND; JLCPCB Part Class: Extended Part
PWR1-PWR8 = A2541WV-3P_C609572: Supplier: LCSC; Supplier Part: C609572; Manufacturer: CJT(Changjiang Connectors); Manufacturer Part: A2541WV-3P; Contributor: LCSC; JLCPCB Part Class: Extended Part
Q1-Q6 = MMBT918: Supplier: LCSC; Supplier Part: C184118; Manufacturer: onsemi(安森美); Contributor: LCSC; JLCPCB Part Class: Extended Part
QWIIC = QWIIC SMD JST: Manufacturer: JST Sales America; Manufacturer Part: SM04B-SRSS-TB(LF)(SN); Supplier: LCSC; Supplier Part: C160404; link: https://www.sparkfun.com/products/14417; Contributor: donhagen
R11-R18 = 0603WAF1000T5E: Supplier: LCSC; Manufacturer: UNI-ROYAL(厚声); Supplier Part: C22775; Resistance (Ohms): 100; JLCPCB Part Class: Basic Part
R29 R44 = 0603WAF3300T5E: Supplier: LCSC; Manufacturer: UNI-ROYAL(厚声); Supplier Part: C23138; Resistance (Ohms): 330; JLCPCB Part Class: Basic Part
SW4 = PEC11R-4015F-S0024: Supplier: LCSC; Supplier Part: C143789; Manufacturer: BOURNS; Contributor: LCSC; JLCPCB Part Class: Extended Part
U1 = SSH1106 128X64 1.3 I2C DISPLAY MODULE: Contributor: bryan_6020
F1 = Fuse-5x20mm: Contributor: Simon-R
Q200-Q207 Q210-Q217 = 2V7002LT3G: Supplier: LCSC; Manufacturer: ON; Contributor: LCSC; Supplier Part: C152521; JLCPCB Part Class: Extended Part
R57 = VDR-10D391K: Supplier: LCSC; Supplier Part: C283937; Manufacturer: VDR   Varistor; Contributor: LCSC; JLCPCB Part Class: Extended Part
REL0-REL7 = FC-D1608HOK-600H: Supplier: LCSC; Manufacturer: NATIONSTAR; Supplier Part: C84269; SMT Type: Extend; JLCPCB SMD: Yes
REL200 = HF115F/012-2ZS4AF: Supplier: LCSC; Supplier Part: C882372; Manufacturer: HF(Xiamen Hongfa Electroacoustic); Contributor: LCSC; JLCPCB Part Class: Extended Part
REL201-REL207 = HF41F/5-ZS: Supplier: LCSC; Manufacturer: HF; Supplier Part: C91698; JLCPCB Part Class: Extended Part
TP1-TP20 = TESTPOIN-SMD-Ø1.2MM: Contributor: NicoFR75
U2 = HLK-5M05_C917669: Supplier: LCSC; Supplier Part: C917669; Manufacturer: TESL*A; Manufacturer Part: HLK-5M05; Contributor: LCSC; JLCPCB Part Class: Extended Part
R20-R28 R30-R37 = 0603WAF4701T5E: Supplier: LCSC; Manufacturer: UNI-ROYAL(厚声); Supplier Part: C23162; Resistance (Ohms): 4.7K; JLCPCB Part Class: Basic Part
U7 = DHT21: Supplier: LCSC; Supplier Part: C2880290; Manufacturer: HAIGU(广州海谷); Contributor: LCSC; JLCPCB Part Class: Extended Part

## Nets
0V: 3.3V.2(K) AC0.2(C) AC1.2(C) AC2.2(C) AC3.2(C) AC4.2(C) AC5.2(C) AC6.2(C) AC7.2(C) C1.1 C6.1 C90.1 C91.1 C100.1 C103.1 C106.1 C107.1 C300.1 C301.1 C302.1 C303.1 C304.1 C305.1 C306.1 C307.1 D10.1(A) D11.2(A) D12.2(A) D13.2(A) D14.2(A) D15.2(A) D16.2(A) D17.2(A) D18.2(A) GND.1 GP1.3(GND) GP1.8(GND) GP1.13(GND) GP1.18(GND) GP1.23(GND) GP1.28(GND) GP1.33(GND) GP1.38(GND) IO1.2 IO2.2 IO3.2 IO4.2 IO5.2 IO6.2 IO7.2 IO8.2 Q200.2(S) Q201.2(S) Q202.2(S) Q203.2(S) Q204.2(S) Q205.2(S) Q206.2(S) Q207.2(S) Q210.2(S) Q211.2(S) Q212.2(S) Q213.2(S) Q214.2(S) Q215.2(S) Q216.2(S) Q217.2(S) QWIIC.1(GND) QWIIC.5(NC1) QWIIC.6(NC2) R19.2 R41.1 R46.2 R110.1 R208.2 SUPPLY.2 SUPPLY.3 SW4.2 SW4.C SW4.MT1 SW4.MT2 TEMP1.2 TEMP2.2 TEMP3.2 TEMP4.2 TEMP5.2 TEMP6.2 TEMP7.2 TEMP8.2 TEMP9.2 TEMP10.2 TEMP11.2 TEMP12.2 TEMP13.2 TEMP14.2 TEMP15.2 TEMP16.2 U1.4(GND) U2.3(-VO) U3.6(E#) U3.7(VEE) U3.8(VSS) U6.6(E#) U6.7(VEE) U6.8(VSS) U7.4(GND) U290.6(E#) U290.7(VEE) U290.8(VSS) U300.3(EM) U301.3(EM) U302.3(EM) U303.3(EM) U304.3(EM) U305.3(EM) U306.3(EM) U307.3(EM) U390.6(E#) U390.7(VEE) U390.8(VSS)
+3V3: 3V3.1 C90.2 C91.2 C100.2 C103.2 C106.2 C107.2 D1.1(C) D2.1(C) D3.1(C) D4.1(C) D5.1(C) D6.1(C) D7.1(C) D8.1(C) D19.1(C) GP1.36(3V3_OUT) PWR1.1 PWR2.1 PWR3.1 PWR4.1 PWR5.1 PWR6.1 PWR7.1 PWR8.1 Q300.2(S) Q301.2(S) Q302.2(S) Q303.2(S) Q304.2(S) Q305.2(S) Q306.2(S) Q307.2(S) QWIIC.2(3.3V) R9.2 R10.2 R20.2 R21.2 R22.2 R23.2 R24.2 R25.2 R26.2 R27.2 R28.2 R30.2 R31.2 R32.2 R33.2 R34.2 R35.2 R36.2 R37.2 R42.2 R300.1 R301.1 R302.1 R303.1 R304.1 R305.1 R306.1 R307.1 TEMP1.1 TEMP2.1 TEMP3.1 TEMP4.1 TEMP5.1 TEMP6.1 TEMP7.1 TEMP8.1 TEMP9.1 TEMP10.1 TEMP11.1 TEMP12.1 TEMP13.1 TEMP14.1 TEMP15.1 TEMP16.1 U1.3(VCC) U3.16(VCC) U6.16(VCC) U7.1(VDD) U290.16(VCC) U390.16(VCC)
+5V: C1.2 D10.2(K) D200.1(K) D201.1(K) D202.1(K) D203.1(K) D204.1(K) D205.1(K) D206.1(K) D207.1(K) GP1.39(VSYS) GP1.40(VBUS) IO_1.2(A) IO_2.2(A) IO_3.2(A) IO_4.2(A) IO_5.2(A) IO_6.2(A) IO_7.2(A) IO_8.2(A) OPTO3.1(A) OPTO4.1(A) PWR1.3 PWR2.3 PWR3.3 PWR4.3 PWR5.3 PWR6.3 PWR7.3 PWR8.3 Q3.3(C) Q4.3(C) R40.2 REL0.2(A) REL1.2(A) REL2.2(A) REL3.2(A) REL4.2(A) REL5.2(A) REL6.2(A) REL7.2(A) REL200.2 REL201.1(COIL) REL202.1(COIL) REL203.1(COIL) REL204.1(COIL) REL205.1(COIL) REL206.1(COIL) REL207.1(COIL) SUPPLY.1 U2.4(+VO) U4.4(COL) U11.4(COL)
A: GP1.9(GP6) SW4.A
ACin0: AC-IN1.4 R370.1
ACin1: AC-IN1.3 R371.1
ACin2: AC-IN1.2 R372.1
ACin3: AC-IN1.1 R373.1
ACin4: AC-IN2.4 R374.1
ACin5: AC-IN2.3 R375.1
ACin6: AC-IN2.2 R376.1
ACin7: AC-IN2.1 R377.1
AIO0: D1.2(A) D11.1(C) GP1.31(GP26) R1.2 R11.1
AIO1: D2.2(A) D12.1(C) GP1.32(GP27) R2.2 R12.1
AIO2: D3.2(A) D13.1(C) GP1.34(GP28) R3.2 R13.1
B: GP1.10(GP7) SW4.B
C: GP1.11(GP8) SW4.1
DHT: GP1.6(GP4) R28.1 U7.2(SDA)
IO3: D4.2(A) D14.1(C) GP1.29(GP22) R4.2 R14.1
IO4: D5.2(A) D15.1(C) GP1.25(GP19) R5.2 R15.1
IO5: D6.2(A) D16.1(C) GP1.24(GP18) R6.2 R16.1
IO6: D7.2(A) D17.1(C) GP1.22(GP17) R7.2 R17.1
IO7: D8.2(A) D18.1(C) GP1.21(GP16) R8.2 R18.1
L: AC-MAINS.1 AC-MAINS.2 F1.2 TP14.1
L0: AC-OUT1.4 REL200.8
L1: AC-OUT1.2 REL201.5(NO)
L2: AC-OUT2.4 REL202.5(NO)
L3: AC-OUT2.2 REL203.5(NO)
L4: AC-OUT3.4 REL204.5(NO)
L5: AC-OUT3.2 REL205.5(NO)
L6: AC-OUT4.4 REL206.5(NO)
L7: AC-OUT4.2 REL207.5(NO)
Mux0: GP1.14(GP10) U3.11(S0) U6.11(S0) U290.11(S0) U390.11(S0)
Mux1: GP1.15(GP11) U3.10(S1) U6.10(S1) U290.10(S1) U390.10(S1)
Mux2: GP1.16(GP12) U3.9(S2) U6.9(S2) U290.9(S2) U390.9(S2)
MuxA: GP1.1(GP0) U3.3(Z)
MuxA0: R26.1 TEMP1.3 U3.13(Y0)
MuxA1: R25.1 TEMP2.3 U3.14(Y1)
MuxA2: R24.1 TEMP3.3 U3.15(Y2)
MuxA3: R27.1 TEMP4.3 U3.12(Y3)
MuxA4: R20.1 TEMP5.3 U3.1(Y4)
MuxA5: R23.1 TEMP6.3 U3.5(Y5)
MuxA6: R21.1 TEMP7.3 U3.2(Y6)
MuxA7: R22.1 TEMP8.3 U3.4(Y7)
MuxAC: GP1.4(GP2) R110.2 U390.3(Z)
MuxAC0: AC0.1(A) R380.1 U390.13(Y0)
MuxAC1: AC1.1(A) R381.1 U390.14(Y1)
MuxAC2: AC2.1(A) R382.1 U390.15(Y2)
MuxAC3: AC3.1(A) R383.1 U390.12(Y3)
MuxAC4: AC4.1(A) R384.1 U390.1(Y4)
MuxAC5: AC5.1(A) R385.1 U390.5(Y5)
MuxAC6: AC6.1(A) R386.1 U390.2(Y6)
MuxAC7: AC7.1(A) R387.1 U390.4(Y7)
MuxB: GP1.2(GP1) U6.3(Z)
MuxB0: R35.1 TEMP9.3 U6.13(Y0)
MuxB1: R36.1 TEMP10.3 U6.14(Y1)
MuxB2: R34.1 TEMP11.3 U6.15(Y2)
MuxB3: R37.1 TEMP12.3 U6.12(Y3)
MuxB4: R30.1 TEMP13.3 U6.1(Y4)
MuxB5: R33.1 TEMP14.3 U6.5(Y5)
MuxB6: R31.1 TEMP15.3 U6.2(Y6)
MuxB7: R32.1 TEMP16.3 U6.4(Y7)
MuxR0: Q210.1(G) R210.2 U290.13(Y0)
MuxR1: Q211.1(G) R211.2 U290.14(Y1)
MuxR2: Q212.1(G) R212.2 U290.15(Y2)
MuxR3: Q213.1(G) R213.2 U290.12(Y3)
MuxR4: Q214.1(G) R214.2 U290.1(Y4)
MuxR5: Q215.1(G) R215.2 U290.5(Y5)
MuxR6: Q216.1(G) R216.2 U290.2(Y6)
MuxR7: Q217.1(G) R217.2 U290.4(Y7)
MuxRel: GP1.5(GP3) U290.3(Z)
N: AC-MAINS.3 AC-MAINS.4 D340.2(A) D341.2(A) D342.2(A) D343.2(A) D344.2(A) D345.2(A) D346.2(A) D347.2(A) D360.1(K) D361.1(K) D362.1(K) D363.1(K) D364.1(K) D365.1(K) D366.1(K) D367.1(K) R57.2 TP4.1 U2.2(AC(L))
Opto0: GP1.7(GP5) OPTO1.2(C) R19.1
Opto1: GP1.17(GP13) OPTO2.2(C) R46.1
Opto2: GP1.19(GP14) R38.1
Opto3: GP1.20(GP15) R39.1
RelEnable: GP1.12(GP9) R200.1 R201.1 R202.1 R203.1 R204.1 R205.1 R206.1 R207.1 R208.1
SCL: GP1.27(GP21) QWIIC.4(SCL) R9.1 SCL.1 U1.2(SCK)
SDA: GP1.26(GP20) QWIIC.3(SDA) R10.1 SDA.1 U1.1(SDA)
Vref: C6.2 D19.2(A) GP1.35(ADC_VREF) R40.1 R41.2
Net-(3.3V-1): 3.3V.1(A) R42.1
Net-(AC-OUT1-1): AC-OUT1.1 TP12.1
Net-(AC-OUT1-3): AC-OUT1.3 TP13.1
Net-(AC-OUT2-1): AC-OUT2.1 TP10.1
Net-(AC-OUT2-3): AC-OUT2.3 TP11.1
Net-(AC-OUT3-1): AC-OUT3.1 TP8.1
Net-(AC-OUT3-3): AC-OUT3.3 TP9.1
Net-(AC-OUT4-1): AC-OUT4.1 TP1.1
Net-(AC-OUT4-3): AC-OUT4.3 TP7.1
Net-(C300-2): C300.2 Q300.1(G) R300.2 U300.4(COL)
Net-(C301-2): C301.2 Q301.1(G) R301.2 U301.4(COL)
Net-(C302-2): C302.2 Q302.1(G) R302.2 U302.4(COL)
Net-(C303-2): C303.2 Q303.1(G) R303.2 U303.4(COL)
Net-(C304-2): C304.2 Q304.1(G) R304.2 U304.4(COL)
Net-(C305-2): C305.2 Q305.1(G) R305.2 U305.4(COL)
Net-(C306-2): C306.2 Q306.1(G) R306.2 U306.4(COL)
Net-(C307-2): C307.2 Q307.1(G) R307.2 U307.4(COL)
Net-(C310-1): C310.1 D330.2(A) D350.2(A) D360.2(A) R320.1 U300.2(CAT)
Net-(C310-2): C310.2 D300.1(C) D320.1(C) Q310.2(S)
Net-(C311-1): C311.1 D331.2(A) D351.2(A) D361.2(A) R321.1 U301.2(CAT)
Net-(C311-2): C311.2 D301.1(C) D321.1(C) Q311.2(S)
Net-(C312-1): C312.1 D332.2(A) D352.2(A) D362.2(A) R322.1 U302.2(CAT)
Net-(C312-2): C312.2 D302.1(C) D322.1(C) Q312.2(S)
Net-(C313-1): C313.1 D333.2(A) D353.2(A) D363.2(A) R323.1 U303.2(CAT)
Net-(C313-2): C313.2 D303.1(C) D323.1(C) Q313.2(S)
Net-(C314-1): C314.1 D334.2(A) D354.2(A) D364.2(A) R324.1 U304.2(CAT)
Net-(C314-2): C314.2 D304.1(C) D324.1(C) Q314.2(S)
Net-(C315-1): C315.1 D335.2(A) D355.2(A) D365.2(A) R325.1 U305.2(CAT)
Net-(C315-2): C315.2 D305.1(C) D325.1(C) Q315.2(S)
Net-(C316-1): C316.1 D336.2(A) D356.2(A) D366.2(A) R326.1 U306.2(CAT)
Net-(C316-2): C316.2 D306.1(C) D326.1(C) Q316.2(S)
Net-(C317-1): C317.1 D337.2(A) D357.2(A) D367.2(A) R327.1 U307.2(CAT)
Net-(C317-2): C317.2 D307.1(C) D327.1(C) Q317.2(S)
Net-(D200-2): D200.2(A) Q200.1(G) Q210.3(D) R220.1 REL200.1
Net-(D201-2): D201.2(A) Q201.1(G) Q211.3(D) R221.1 REL201.2(COIL)
Net-(D202-2): D202.2(A) Q202.1(G) Q212.3(D) R222.1 REL202.2(COIL)
Net-(D203-2): D203.2(A) Q203.1(G) Q213.3(D) R223.1 REL203.2(COIL)
Net-(D204-2): D204.2(A) Q204.1(G) Q214.3(D) R224.1 REL204.2(COIL)
Net-(D205-2): D205.2(A) Q205.1(G) Q215.3(D) R225.1 REL205.2(COIL)
Net-(D206-2): D206.2(A) Q206.1(G) Q216.3(D) R226.1 REL206.2(COIL)
Net-(D207-2): D207.2(A) Q207.1(G) Q217.3(D) R227.1 REL207.2(COIL)
Net-(D300-2): D300.2(A) D310.1(K) D340.1(K) Q310.1(G) R320.2
Net-(D301-2): D301.2(A) D311.1(K) D341.1(K) Q311.1(G) R321.2
Net-(D302-2): D302.2(A) D312.1(K) D342.1(K) Q312.1(G) R322.2
Net-(D303-2): D303.2(A) D313.1(K) D343.1(K) Q313.1(G) R323.2
Net-(D304-2): D304.2(A) D314.1(K) D344.1(K) Q314.1(G) R324.2
Net-(D305-2): D305.2(A) D315.1(K) D345.1(K) Q315.1(G) R325.2
Net-(D306-2): D306.2(A) D316.1(K) D346.1(K) Q316.1(G) R326.2
Net-(D307-2): D307.2(A) D317.1(K) D347.1(K) Q317.1(G) R327.2
Net-(D310-2): D310.2(A) D350.1(K) R330.2
Net-(D311-2): D311.2(A) D351.1(K) R331.2
Net-(D312-2): D312.2(A) D352.1(K) R332.2
Net-(D313-2): D313.2(A) D353.1(K) R333.2
Net-(D314-2): D314.2(A) D354.1(K) R334.2
Net-(D315-2): D315.2(A) D355.1(K) R335.2
Net-(D316-2): D316.2(A) D356.1(K) R336.2
Net-(D317-2): D317.2(A) D357.1(K) R337.2
Net-(D320-2): D320.2(A) D330.1(C)
Net-(D321-2): D321.2(A) D331.1(C)
Net-(D322-2): D322.2(A) D332.1(C)
Net-(D323-2): D323.2(A) D333.1(C)
Net-(D324-2): D324.2(A) D334.1(C)
Net-(D325-2): D325.2(A) D335.1(C)
Net-(D326-2): D326.2(A) D336.1(C)
Net-(D327-2): D327.2(A) D337.1(C)
Net-(F1-1): F1.1 R57.1 U2.1(AC(N))
Net-(IO1-1): IO1.1 PWR1.2
Net-(IO1-3): IO1.3 R11.2
Net-(IO2-1): IO2.1 PWR2.2
Net-(IO2-3): IO2.3 R12.2
Net-(IO3-1): IO3.1 PWR3.2
Net-(IO3-3): IO3.3 R13.2
Net-(IO4-1): IO4.1 PWR4.2
Net-(IO4-3): IO4.3 R14.2
Net-(IO5-1): IO5.1 PWR5.2
Net-(IO5-3): IO5.3 R15.2
Net-(IO6-1): IO6.1 PWR6.2
Net-(IO6-3): IO6.3 R16.2
Net-(IO7-1): IO7.1 PWR7.2
Net-(IO7-3): IO7.3 R17.2
Net-(IO8-1): IO8.1 PWR8.2
Net-(IO8-3): IO8.3 R18.2
Net-(IO_1-1): IO_1.1(K) R1.1
Net-(IO_2-1): IO_2.1(K) R2.1
Net-(IO_3-1): IO_3.1(K) R3.1
Net-(IO_4-1): IO_4.1(K) R4.1
Net-(IO_5-1): IO_5.1(K) R5.1
Net-(IO_6-1): IO_6.1(K) R6.1
Net-(IO_7-1): IO_7.1(K) R7.1
Net-(IO_8-1): IO_8.1(K) R8.1
Net-(OPTO1-1): OPTO1.1(A) Q3.2(E)
Net-(OPTO2-1): OPTO2.1(A) Q4.2(E)
Net-(OPTO3-2): OPTO3.2(C) U13.1(AN)
Net-(OPTO4-2): OPTO4.2(C) U14.1(AN)
Net-(OPTOIN-1): OPTOIN.1 R43.2 U11.1(AN)
Net-(OPTOIN-2): OPTOIN.2 Q2.2(E) R29.1
Net-(OPTOIN-3): OPTOIN.3 R45.2 U4.1(AN)
Net-(OPTOIN-4): OPTOIN.4 Q6.2(E) R44.1
Net-(OPTOOUT-1): OPTOOUT.1 U13.4(COL)
Net-(OPTOOUT-2): OPTOOUT.2 U13.3(EM)
Net-(OPTOOUT-3): OPTOOUT.3 U14.4(COL)
Net-(OPTOOUT-4): OPTOOUT.4 U14.3(EM)
Net-(Q1-1): Q1.1(B) Q2.3(C) R43.1
Net-(Q1-2): Q1.2(E) Q2.1(B) R29.2
Net-(Q1-3): Q1.3(C) U11.2(CAT)
Net-(Q3-1): Q3.1(B) U11.3(EM)
Net-(Q4-1): Q4.1(B) U4.3(EM)
Net-(Q5-1): Q5.1(B) Q6.3(C) R45.1
Net-(Q5-2): Q5.2(E) Q6.1(B) R44.2
Net-(Q5-3): Q5.3(C) U4.2(CAT)
Net-(Q200-3): Q200.3(D) R200.2 R210.1
Net-(Q201-3): Q201.3(D) R201.2 R211.1
Net-(Q202-3): Q202.3(D) R202.2 R212.1
Net-(Q203-3): Q203.3(D) R203.2 R213.1
Net-(Q204-3): Q204.3(D) R204.2 R214.1
Net-(Q205-3): Q205.3(D) R205.2 R215.1
Net-(Q206-3): Q206.3(D) R206.2 R216.1
Net-(Q207-3): Q207.3(D) R207.2 R217.1
Net-(Q300-3): Q300.3(D) R380.2
Net-(Q301-3): Q301.3(D) R381.2
Net-(Q302-3): Q302.3(D) R382.2
Net-(Q303-3): Q303.3(D) R383.2
Net-(Q304-3): Q304.3(D) R384.2
Net-(Q305-3): Q305.3(D) R385.2
Net-(Q306-3): Q306.3(D) R386.2
Net-(Q307-3): Q307.3(D) R387.2
Net-(Q310-3): Q310.3(D) R310.2
Net-(Q311-3): Q311.3(D) R311.2
Net-(Q312-3): Q312.3(D) R312.2
Net-(Q313-3): Q313.3(D) R313.2
Net-(Q314-3): Q314.3(D) R314.2
Net-(Q315-3): Q315.3(D) R315.2
Net-(Q316-3): Q316.3(D) R316.2
Net-(Q317-3): Q317.3(D) R317.2
Net-(R38-2): R38.2 U13.2(CAT)
Net-(R39-2): R39.2 U14.2(CAT)
Net-(R220-2): R220.2 REL0.1(K)
Net-(R221-2): R221.2 REL1.1(K)
Net-(R222-2): R222.2 REL2.1(K)
Net-(R223-2): R223.2 REL3.1(K)
Net-(R224-2): R224.2 REL4.1(K)
Net-(R225-2): R225.2 REL5.1(K)
Net-(R226-2): R226.2 REL6.1(K)
Net-(R227-2): R227.2 REL7.1(K)
Net-(R310-1): R310.1 U300.1(AN)
Net-(R311-1): R311.1 U301.1(AN)
Net-(R312-1): R312.1 U302.1(AN)
Net-(R313-1): R313.1 U303.1(AN)
Net-(R314-1): R314.1 U304.1(AN)
Net-(R315-1): R315.1 U305.1(AN)
Net-(R316-1): R316.1 U306.1(AN)
Net-(R317-1): R317.1 U307.1(AN)
Net-(R330-1): R330.1 R340.2
Net-(R331-1): R331.1 R341.2
Net-(R332-1): R332.1 R342.2
Net-(R333-1): R333.1 R343.2
Net-(R334-1): R334.1 R344.2
Net-(R335-1): R335.1 R345.2
Net-(R336-1): R336.1 R346.2
Net-(R337-1): R337.1 R347.2
Net-(R340-1): R340.1 R350.2
Net-(R341-1): R341.1 R351.2
Net-(R342-1): R342.1 R352.2
Net-(R343-1): R343.1 R353.2
Net-(R344-1): R344.1 R354.2
Net-(R345-1): R345.1 R355.2
Net-(R346-1): R346.1 R356.2
Net-(R347-1): R347.1 R357.2
Net-(R350-1): R350.1 R360.2
Net-(R351-1): R351.1 R361.2
Net-(R352-1): R352.1 R362.2
Net-(R353-1): R353.1 R363.2
Net-(R354-1): R354.1 R364.2
Net-(R355-1): R355.1 R365.2
Net-(R356-1): R356.1 R366.2
Net-(R357-1): R357.1 R367.2
Net-(R360-1): R360.1 R370.2
Net-(R361-1): R361.1 R371.2
Net-(R362-1): R362.1 R372.2
Net-(R363-1): R363.1 R373.2
Net-(R364-1): R364.1 R374.2
Net-(R365-1): R365.1 R375.2
Net-(R366-1): R366.1 R376.2
Net-(R367-1): R367.1 R377.2
Net-(REL200-5): REL200.5 TP5.1
Net-(REL200-6): REL200.6 TP2.1
Net-(REL200-7): REL200.7 TP3.1
Net-(REL201-4): REL201.4(COM) TP6.1
Net-(REL202-4): REL202.4(COM) TP20.1
Net-(REL203-4): REL203.4(COM) TP19.1
Net-(REL204-4): REL204.4(COM) TP18.1
Net-(REL205-4): REL205.4(COM) TP17.1
Net-(REL206-4): REL206.4(COM) TP16.1
Net-(REL207-4): REL207.4(COM) TP15.1

Not connected (* = marked no-connect by the designer): GP1 30(RUN)* 37(3V3_EN)* 41(SWCLK)* 42(GND)* 43(SWDIO)* 44(TP1)* 45(TP2)* 46(TP3)* 47(TP4)* 48(TP5)* 49(TP6)* 50(USB_SHIELD)*; REL200 3* 4*; REL201 3(NC)*; REL202 3(NC)*; REL203 3(NC)*; REL204 3(NC)*; REL205 3(NC)*; REL206 3(NC)*; REL207 3(NC)*; U7 3(NC)*

## Notes on the sheets
sheet 1
- Temperature Sensors and one DHT Hygrometric Sensor
sheet 2
- fast/direct I/O
- Optocoupler In & Out
- optional QWIIC
- Sparkfunk part PRT-14417
- SM04B-SRSS-TB(LF)(SN)
- Housing: Panasonic BQDT2161 90912116
sheet 3
- AC (Mains) Digital Inputs
sheet 4
- 8 relays including one 16A relay
- 90 Ohm
- HF41F/6-ZS: 212 Ohm
- Optional Power Supply
